# EAGLE design hacktor_watch2 (EAGLE 9.7.0)

## Sheet 1 of 2
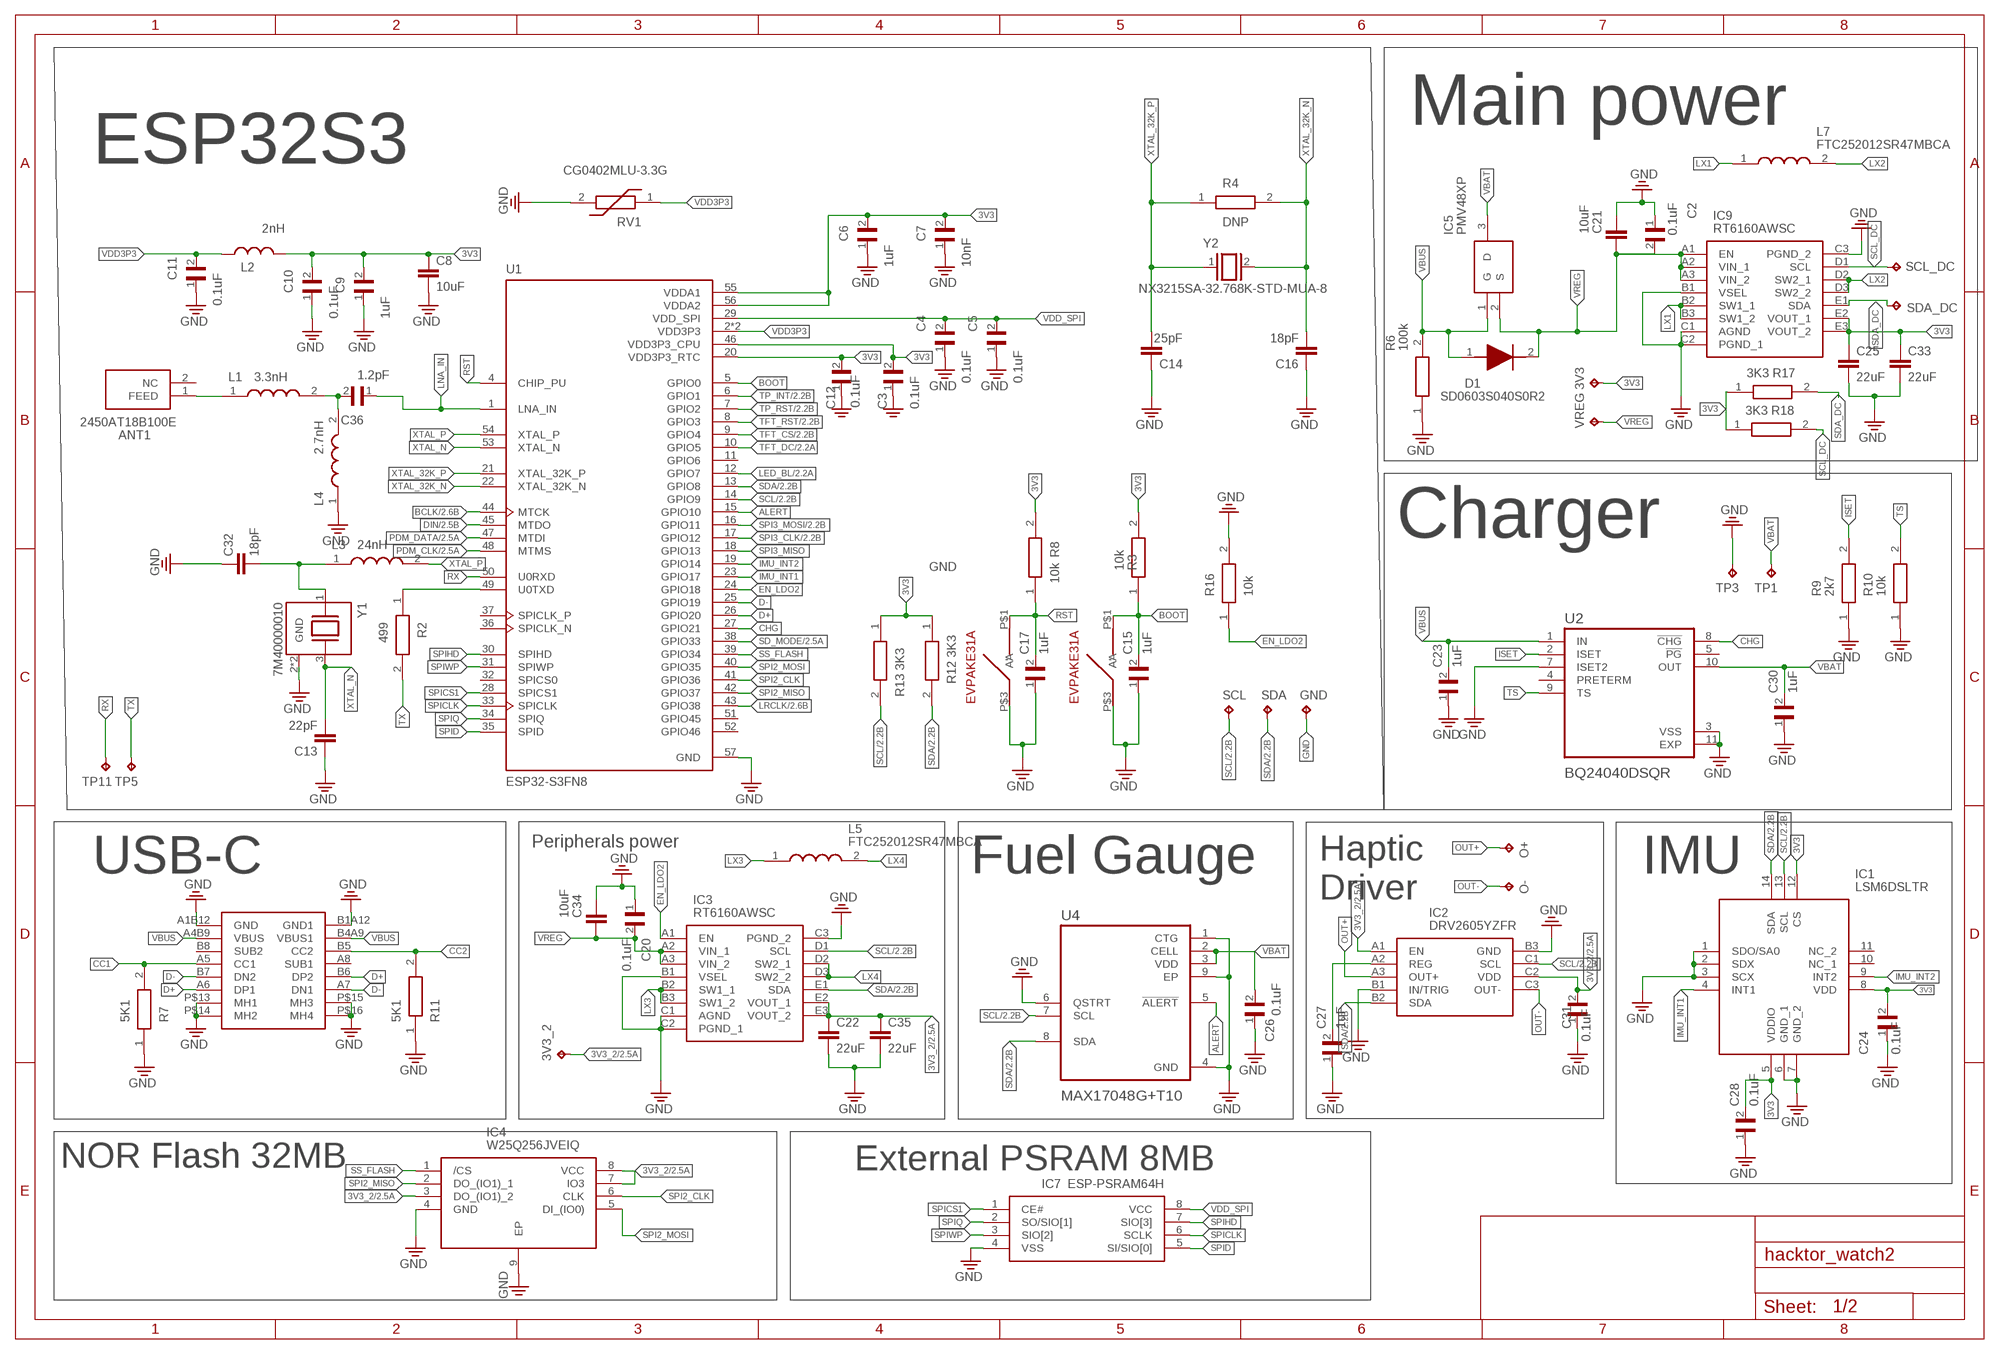
[diagram p0: schematic, sheet 1]

### Parts
3V3  TPTP20R  [TP20R]
3V3_2  TPTP20R  [TP20R]
ANT1  2450AT18B100E  [ANTC3216X140N]
C2  0.1uF  GRM011R60J152KE01L  [0201]
C3  0.1uF  GRM011R60J152KE01L  [0201]
C4  0.1uF  GRM011R60J152KE01L  [0201]
C5  0.1uF  GRM011R60J152KE01L  [0201]
C6  1uF  GRM011R60J152KE01L  [0201]
C7  10nF  GRM011R60J152KE01L  [0201]
C8  10uF  CAP_0402  [0402]
C9  1uF  GRM011R60J152KE01L  [0201]
C10  0.1uF  GRM011R60J152KE01L  [0201]
C11  0.1uF  GRM011R60J152KE01L  [0201]
C12  0.1uF  GRM011R60J152KE01L  [0201]
C13  22pF  CAP_0402  [0402]
C14  25pF  CAP_0402  [0402]
C15  1uF  GRM011R60J152KE01L  [0201]
C16  18pF  CAP_0402  [0402]
C17  1uF  GRM011R60J152KE01L  [0201]
C20  0.1uF  GRM011R60J152KE01L  [0201]
C21  10uF  CAP_0402  [0402]
C22  22uF  CAP_0402  [0402]
C23  1uF  GRM011R60J152KE01L  [0201]
C24  0.1uF  GRM011R60J152KE01L  [0201]
C25  22uF  CAP_0402  [0402]
C26  0.1uF  GRM011R60J152KE01L  [0201]
C27  1uF  GRM011R60J152KE01L  [0201]
C28  0.1uF  GRM011R60J152KE01L  [0201]
C30  1uF  GRM011R60J152KE01L  [0201]
C31  0.1uF  GRM011R60J152KE01L  [0201]
C32  18pF  CAP_0402  [0402]
C33  22uF  CAP_0402  [0402]
C34  10uF  CAP_0402  [0402]
C35  22uF  CAP_0402  [0402]
C36  1.2pF  GRM011R60J152KE01L  [0201]
D1  SD0603S040S0R2  [SD0603]
GND  TPTP20R  [TP20R]
IC1  LSM6DSLTR  [LSM6DSLTR]
IC2  DRV2605YZFR  [BGA9C50P3X3_144X144X62]
IC3  RT6160AWSC  [BGA15C40P3X5_140X230X60]
IC4  W25Q256JVEIQ  [SON127P800X600X80-9N]
IC5  PMV48XP  [SOT95P230X110-3N]
IC7  ESP-PSRAM64H  [SOIC127P600X175-8N]
IC9  RT6160AWSC  [BGA15C40P3X5_140X230X60]
L1  3.3nH  LQP15MN5N6B02D  [LQP15MN10NG02D]
L2  2nH  INDUCTOR_CHIP-0402(1006-METRIC)  [INDC1006X60N]
L3  24nH  LQP15MN5N6B02D  [LQP15MN10NG02D]
L4  2.7nH  LQP15MN5N6B02D  [LQP15MN10NG02D]
L5  FTC252012SR47MBCA  [INDC2016X100N]
L7  FTC252012SR47MBCA  [INDC2016X100N]
O+  TPTP20R  [TP20R]
O-  TPTP20R  [TP20R]
R2  499  CPF0201D7K68C1  [0201]
R3  10k  CPF0201D7K68C1  [0201]
R4  DNP  CPF0201D7K68C1  [0201]
R6  100k  CPF0201D7K68C1  [0201]
R7  5K1  CPF0201D7K68C1  [0201]
R8  10k  CPF0201D7K68C1  [0201]
R9  2k7  CPF0201D7K68C1  [0201]
R10  10k  CPF0201D7K68C1  [0201]
R11  5K1  CPF0201D7K68C1  [0201]
R12  3K3  CPF0201D7K68C1  [0201]
R13  3K3  CPF0201D7K68C1  [0201]
R16  10k  CPF0201D7K68C1  [0201]
R17  3K3  CPF0201D7K68C1  [0201]
R18  3K3  CPF0201D7K68C1  [0201]
RV1  CG0402MLU-3.3G  [VARC1005X41N]
SCL  TPTP20R  [TP20R]
SCL_DC  TPTP20R  [TP20R]
SDA  TPTP20R  [TP20R]
SDA_DC  TPTP20R  [TP20R]
TP1  TPTP20R  [TP20R]
TP3  TPTP20R  [TP20R]
TP5  TPTP20R  [TP20R]
TP11  TPTP20R  [TP20R]
U1  ESP32-S3FN8  [QFN40P700X700X90-57N]
U2  BQ24040DSQR  [SON40P200X200X80-11N]
U4  MAX17048G+T10  [SON50P200X200X80-9N]
U$1  EVPAKE31A  [EVPAKE31A]
U$3  EVPAKE31A  [EVPAKE31A]
U$5  TYPE-C16PCB0.8073  [TYPE-C16PCB0.8073]
VREG  TPTP20R  [TP20R]
Y1  7M40000010  [XTAL_7M40000010]
Y2  NX3215SA-32.768K-STD-MUA-8  [XTAL_NX3215SA-32.768K-STD-MUA-8]

### Nets
3V3 [power]: 3V3.TP C3.2 C6.2 C7.2 C8.1 C9.2 C10.2 C12.2 C24.2 C25.1 C28.2 C33.1 IC1.5(VDDIO) IC1.8(VDD) IC1.12(CS) IC9.E2(VOUT_1) IC9.E3(VOUT_2) L2.2 R3.2 R8.2 R12.1 R13.1 R17.1 R18.1 U1.20(VDD3P3_RTC) U1.46(VDD3P3_CPU) U1.55(VDDA1) U1.56(VDDA2)
3V3_2 [power]: 3V3_2.TP C22.1 C31.2 C35.1 IC2.A1(EN) IC2.C2(VDD) IC3.E2(VOUT_1) IC3.E3(VOUT_2) IC4.3(DO_(IO1)_2) IC4.7(IO3) IC4.8(VCC) ; also sheet 2
ALERT: U1.15(GPIO10) U4.5(!ALERT)
BCLK: U1.44(MTCK) ; also sheet 2
BOOT: C15.2 R3.1 U1.5(GPIO0) U$1.P$1(A)
CC1: R7.2 U$5.A5(CC1)
CC2: R11.2 U$5.B5(CC2)
CHG: U1.27(GPIO21) U2.8(!CHG)
D+: U1.26(GPIO20) U$5.A6(DP1) U$5.B6(DP2)
D-: U1.25(GPIO19) U$5.A7(DN1) U$5.B7(DN2)
DIN: U1.45(MTDO) ; also sheet 2
EN_LDO2: IC3.A1(EN) R16.1 U1.24(GPIO18)
GND: C2.1 C3.1 C4.1 C5.1 C6.1 C7.1 C8.2 C9.1 C10.1 C11.1 C12.1 C13.1 C14.1 C15.1 C16.1 C17.1 C20.1 C21.1 C22.2 C23.1 C24.1 C25.2 C26.1 C27.1 C28.1 C30.1 C31.1 C32.1 C33.2 C34.1 C35.2 GND.TP IC1.1(SDO/SA0) IC1.2(SDX) IC1.3(SCX) IC1.6(GND_1) IC1.7(GND_2) IC2.B1(IN/TRIG) IC2.B3(GND) IC3.B1(VSEL) IC3.C1(AGND) IC3.C2(PGND_1) IC3.C3(PGND_2) IC4.4(GND) IC4.9(EP) IC7.4(VSS) IC9.B1(VSEL) IC9.C1(AGND) IC9.C2(PGND_1) IC9.C3(PGND_2) L4.1 R6.1 R7.1 R9.1 R10.1 R11.1 R16.2 RV1.2 TP3.TP U1.57(GND) U2.3(VSS) U2.7(ISET2) U2.11(EXP) U4.1(CTG) U4.4(GND) U4.6(QSTRT) U4.9(EP) U$1.P$3(A') U$3.P$3(A') U$5.A1B12(GND) U$5.B1A12(GND1) U$5.P$13(MH1) U$5.P$14(MH2) U$5.P$15(MH3) U$5.P$16(MH4) Y1.2(GND) Y1.4(GND) ; also sheet 2
IMU_INT1: IC1.4(INT1) U1.23(GPIO17)
IMU_INT2: IC1.9(INT2) U1.19(GPIO14)
ISET: R9.2 U2.2(ISET)
LED_BL: U1.12(GPIO7) ; also sheet 2
LNA_IN: C36.1 U1.1(LNA_IN)
LRCLK: U1.43(GPIO38) ; also sheet 2
LX1: IC9.B2(SW1_1) IC9.B3(SW1_2) L7.1
LX2: IC9.D2(SW2_1) IC9.D3(SW2_2) L7.2
LX3: IC3.B2(SW1_1) IC3.B3(SW1_2) L5.1
LX4: IC3.D2(SW2_1) IC3.D3(SW2_2) L5.2
N$2: C32.2 L3.1 Y1.1
N$3: ANT1.1(FEED) L1.1
N$4: C36.2 L1.2 L4.2
N$7: R2.1 U1.49(U0TXD)
N$19: C27.2 IC2.A2(REG)
OUT+: IC2.A3(OUT+) O+.TP
OUT-: IC2.C3(OUT-) O-.TP
PDM_CLK: U1.48(MTMS) ; also sheet 2
PDM_DATA: U1.47(MTDI) ; also sheet 2
RST: C17.2 R8.1 U1.4(CHIP_PU) U$3.P$1(A)
RX: TP11.TP U1.50(U0RXD)
SCL: IC1.13(SCL) IC2.C1(SCL) IC3.D1(SCL) R13.2 SCL.TP U1.14(GPIO9) U4.7(SCL) ; also sheet 2
SCL_DC: IC9.D1(SCL) R18.2 SCL_DC.TP
SD_MODE: U1.38(GPIO33) ; also sheet 2
SDA: IC1.14(SDA) IC2.B2(SDA) IC3.E1(SDA) R12.2 SDA.TP U1.13(GPIO8) U4.8(SDA) ; also sheet 2
SDA_DC: IC9.E1(SDA) R17.2 SDA_DC.TP
SPI2_CLK: IC4.6(CLK) U1.41(GPIO36)
SPI2_MISO: IC4.2(DO_(IO1)_1) U1.42(GPIO37)
SPI2_MOSI: IC4.5(DI_(IO0)) U1.40(GPIO35)
SPI3_CLK: U1.17(GPIO12) ; also sheet 2
SPI3_MISO: U1.18(GPIO13)
SPI3_MOSI: U1.16(GPIO11) ; also sheet 2
SPICLK: IC7.6(SCLK) U1.33(SPICLK)
SPICS1: IC7.1(CE#) U1.28(SPICS1)
SPID: IC7.5(SI/SIO[0]) U1.35(SPID)
SPIHD: IC7.7(SIO[3]) U1.30(SPIHD)
SPIQ: IC7.2(SO/SIO[1]) U1.34(SPIQ)
SPIWP: IC7.3(SIO[2]) U1.31(SPIWP)
SS_FLASH: IC4.1(/CS) U1.39(GPIO34)
TFT_CS: U1.9(GPIO4) ; also sheet 2
TFT_DC: U1.10(GPIO5) ; also sheet 2
TFT_RST: U1.8(GPIO3) ; also sheet 2
TP_INT: U1.6(GPIO1) ; also sheet 2
TP_RST: U1.7(GPIO2) ; also sheet 2
TS: R10.2 U2.9(TS)
TX: R2.2 TP5.TP
VBAT [power]: C26.2 C30.2 IC5.3(D) TP1.TP U2.10(OUT) U4.2(CELL) U4.3(VDD)
VBUS [power]: C23.2 D1.1(A) IC5.1(G) R6.2 U2.1(IN) U$5.A4B9(VBUS) U$5.B4A9(VBUS1)
VDD3P3 [power]: C11.2 L2.1 RV1.1 U1.2(VDD3P3) U1.3(VDD3P3)
VDD_SPI [power]: C4.2 C5.2 IC7.8(VCC) U1.29(VDD_SPI)
VREG [power]: C2.2 C20.2 C21.2 C34.2 D1.2(K) IC3.A2(VIN_1) IC3.A3(VIN_2) IC5.2(S) IC9.A1(EN) IC9.A2(VIN_1) IC9.A3(VIN_2) VREG.TP
XTAL_32K_N: C16.2 R4.2 U1.22(XTAL_32K_N) Y2.2
XTAL_32K_P: C14.2 R4.1 U1.21(XTAL_32K_P) Y2.1
XTAL_N: C13.2 U1.53(XTAL_N) Y1.3
XTAL_P: L3.2 U1.54(XTAL_P)
Unconnected: ANT1.2(NC) IC1.10(NC_1) IC1.11(NC_2) U1.11(GPIO6) U1.32(SPICS0) U1.36(SPICLK_N) U1.37(SPICLK_P) U1.51(GPIO45) U1.52(GPIO46) U2.4(PRETERM) U2.5(!PG) U$5.A8(SUB1) U$5.B8(SUB2)

### Notes on the sheet
- Main power
- ESP32S3
- Charger
- Peripherals power
- USB-C | Fuel Gauge | IMU
- Haptic 
  Driver
- NOR Flash 32MB | External PSRAM 8MB

## Sheet 2 of 2
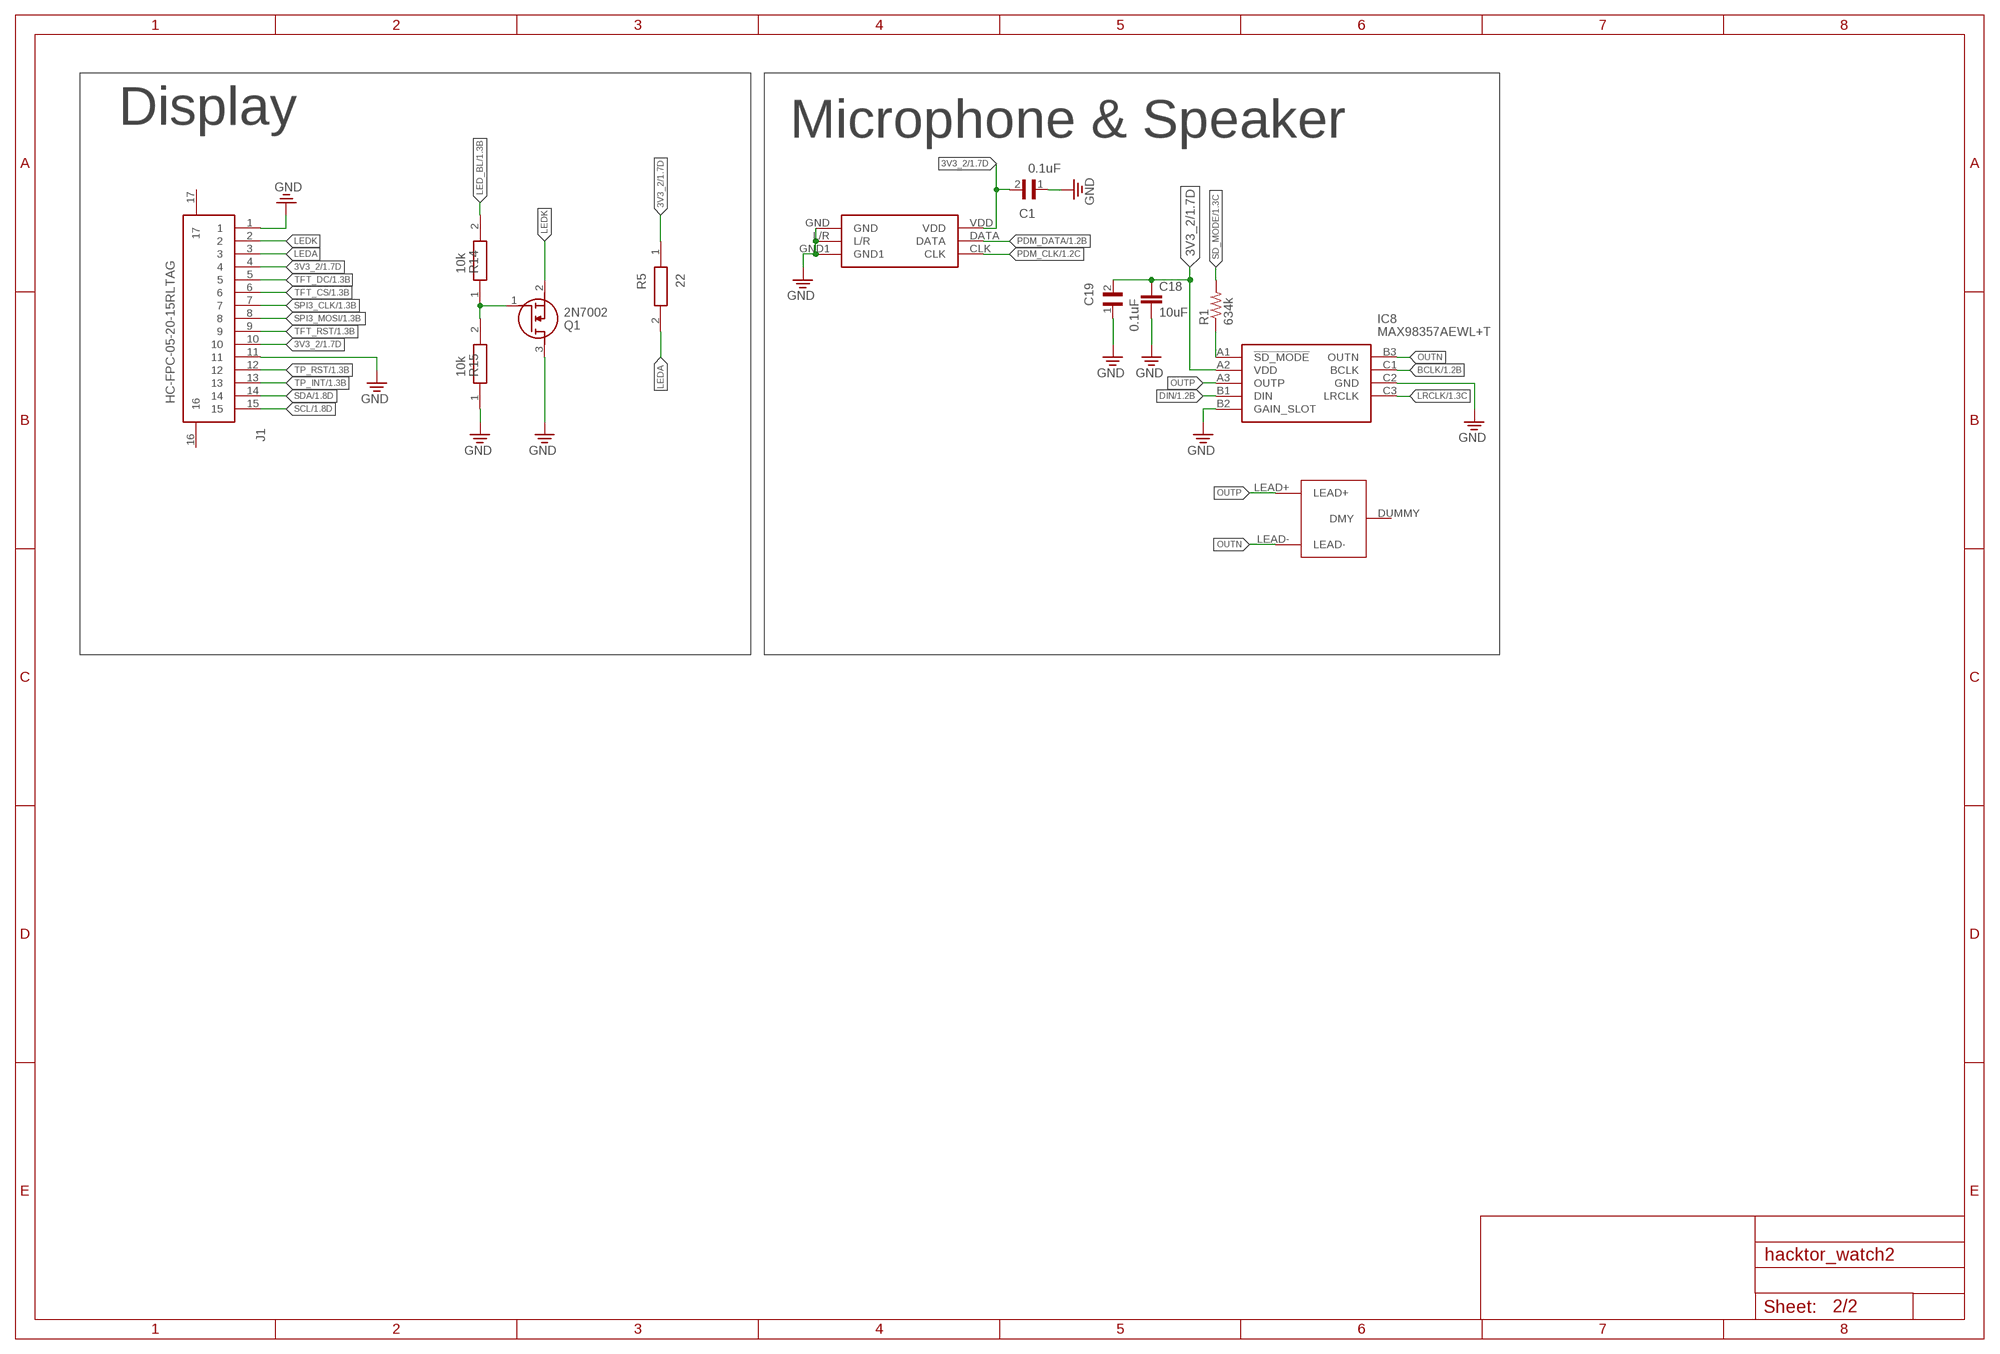
[diagram p1: schematic, sheet 2]

### Parts
C1  0.1uF  GRM011R60J152KE01L  [0201]
C18  10uF  CAP_0402  [0402]
C19  0.1uF  GRM011R60J152KE01L  [0201]
IC8  MAX98357AEWL+T  [BGA9C40P3X3_144X135X69]
J1  HC-FPC-05-20-15RLTAG  [HC-FPC-05-20-15RLTAG]
Q1  2N7002  [SOT96P240X120-3N]
R1  634k  RES_0402  [0402]
R5  22  CPF0201D7K68C1  [0201]
R14  10k  CPF0201D7K68C1  [0201]
R15  10k  CPF0201D7K68C1  [0201]
U$4  TE054003-1  [TE054003-1]
U$6  LMD2718T261-OA1  [LMD2718T261-OA1]

### Nets
3V3_2 [power]: C1.2 C18.1 C19.2 IC8.A2(VDD) J1.4 J1.10 R5.1 U$6.VDD ; also sheet 1
BCLK: IC8.C1(BCLK) ; also sheet 1
DIN: IC8.B1(DIN) ; also sheet 1
GND: C1.1 C18.2 C19.1 IC8.B2(GAIN_SLOT) IC8.C2(GND) J1.1 J1.11 Q1.3(D) R15.1 U$6.GND U$6.GND1 U$6.L/R ; also sheet 1
LED_BL: R14.2 ; also sheet 1
LEDA: J1.3 R5.2
LEDK: J1.2 Q1.2(S)
LRCLK: IC8.C3(LRCLK) ; also sheet 1
N$1: IC8.A1(!SD_MODE) R1.1
N$17: Q1.1(G) R14.1 R15.2
OUTN: IC8.B3(OUTN) U$4.LEAD-
OUTP: IC8.A3(OUTP) U$4.LEAD+
PDM_CLK: U$6.CLK ; also sheet 1
PDM_DATA: U$6.DATA ; also sheet 1
SCL: J1.15 ; also sheet 1
SD_MODE: R1.2 ; also sheet 1
SDA: J1.14 ; also sheet 1
SPI3_CLK: J1.7 ; also sheet 1
SPI3_MOSI: J1.8 ; also sheet 1
TFT_CS: J1.6 ; also sheet 1
TFT_DC: J1.5 ; also sheet 1
TFT_RST: J1.9 ; also sheet 1
TP_INT: J1.13 ; also sheet 1
TP_RST: J1.12 ; also sheet 1
Unconnected: J1.16 J1.17 U$4.DUMMY(DMY)

### Notes on the sheet
- Display | Microphone & Speaker

## Library data of the parts
3V3 3V3_2 GND O+ O- SCL SCL_DC SDA SDA_DC TP1 TP3 TP5 TP11 VREG = Hector_Watch:TP: Test pad
ANT1 = 2450AT18B100E:2450AT18B100E: Antennas 2.45GHz ANTENNA Source: Datasheet <https://www.johansontechnology.com/datasheets/2450AT18B100/2450AT18B100.pdf>; ARROW_PART_NUMBER: 2450AT18B100E; ARROW_PRICE-STOCK: https://www.arrow.com/en/products/2450at18b100e/johanson-dielectrics?utm_currency=USD&region=nac; DESCRIPTION: Antennas 2.45GHz ANTENNA; HEIGHT: 1.4mm; MANUFACTURER_NAME: JOHANSON TECHNOLOGY; MANUFACTURER_PART_NUMBER: 2450AT18B100E; MOUSER_PART_NUMBER: 609-2450AT18B100E; MOUSER_PRICE-STOCK: https://www.mouser.co.uk/ProductDetail/Johanson-Technology/2450AT18B100E?qs=yCnrNFeXz%252Bh5MFsFIXGZGA%3D%3D
C1-C7 C9-C12 C15 C17 C19 C20 C23 C24 C26-C28 C30 C31 C36 = GRM011R60J152KE01L:GRM011R60J152KE01L: Check availability <https://pricing.snapeda.com/parts/GRM011R60J152KE01L/Murata/view-part?ref=eda>; SPICEPREFIX: C
C8 C13 C14 C16 C18 C21 C22 C25 C32-C35 = Perfect_0402:CAP_0402: 0402 (1005 Metric) Nick Garner - TeleSense
D1 = SD0603S040S0R2:SD0603S040S0R2: Schottky Barrier Rectifier Diode Source: Datasheet <http://datasheets.avx.com/schottky.pdf>; ARROW_PART_NUMBER: SD0603S040S0R2; ARROW_PRICE-STOCK: https://www.arrow.com/en/products/sd0603s040s0r2/avx?region=europe; DESCRIPTION: Schottky Barrier Rectifier Diode; HEIGHT: mm; MANUFACTURER_NAME: Kyocera AVX; MANUFACTURER_PART_NUMBER: SD0603S040S0R2; MOUSER_PART_NUMBER: 581-SD0603S040S0R2; MOUSER_PRICE-STOCK: https://www.mouser.co.uk/ProductDetail/KYOCERA-AVX/SD0603S040S0R2?qs=jCA%252BPfw4LHYAQo0EAXFnAA%3D%3D
IC1 = LSM6DSLTR:LSM6DSLTR: IMUs - Inertial Measurement Units CONSUMER MEMS Source: Datasheet <https://www.st.com/resource/en/datasheet/lsm6dsl.pdf> Check availability <https://pricing.snapeda.com/parts/LSM6DSLTR/Analog%20Devices/view-part?ref=eda>; AVAILABILITY: In Stock; CHECK_PRICES: https://www.snapeda.com/parts/LSM6DSLTR/Analog+Devices/view-part/?ref=eda; DESCRIPTION: Inemo Inertial Module, 2/4/8/16G, Lga-14; Mems Module Function:Tri-Axis Gyroscope, Tri-Axis Accelerometer; Supply Voltage Min:1.71V; Supply Voltage Max:3.6V; Sensor Case Style:Lga; No. Of Pins:14Pins; Product Range:- Rohs Compliant: Yes |Stmicroelectronics LSM6DSLTR; MF: Analog Devices; MP: LSM6DSLTR; PACKAGE: None; PRICE: None; PURCHASE-URL: https://www.snapeda.com/api/url_track_click_mouser/?unipart_id=12092544&manufacturer=Analog Devices&part_name=LSM6DSLTR&search_term=lsm6dsltr; SNAPEDA_LINK: https://www.snapeda.com/parts/LSM6DSLTR/Analog+Devices/view-part/?ref=snap
IC2 = DRV2605YZFR:DRV2605YZFR: Haptic Driver for ERM/LRA with Built-In Library and Smart Loop Architecture Source: Datasheet <http://www.ti.com/lit/gpn/drv2605>; ARROW_PART_NUMBER: DRV2605YZFR; ARROW_PRICE-STOCK: https://www.arrow.com/en/products/drv2605yzfr/texas-instruments?region=nac; DESCRIPTION: Haptic Driver for ERM/LRA with Built-In Library and Smart Loop Architecture; HEIGHT: 0.625mm; MANUFACTURER_NAME: Texas Instruments; MANUFACTURER_PART_NUMBER: DRV2605YZFR
IC3 IC9 = RT6160AWSC:RT6160AWSC: Buck-Boost Regulator Positive Output Step-Up/Step-Down I2C DC-DC Controller IC 15-WL-CSP (BSC) (1.4x2.3) Source: Datasheet <https://www.richtek.com/SaveDownload.aspx?specid=RT6160A>; DESCRIPTION: Buck-Boost Regulator Positive Output Step-Up/Step-Down I2C DC-DC Controller IC 15-WL-CSP (BSC) (1.4x2.3); HEIGHT: 0.6mm; MANUFACTURER_NAME: RICHTEK; MANUFACTURER_PART_NUMBER: RT6160AWSC; MOUSER_PART_NUMBER: 835-RT6160AWSC; MOUSER_PRICE-STOCK: https://www.mouser.co.uk/ProductDetail/Richtek/RT6160AWSC?qs=amGC7iS6iy%2FLd9PSoixZXQ%3D%3D
IC4 = W25Q256JVEIQ:W25Q256JVEIQ: 256M-bit Serial Flash Memory with uniform 4KB sectors and Dual/Quad SPI Source: Datasheet <https://www.winbond.com/hq/search-resource-file.jsp?partNo=W25Q256JVEIQ&type=datasheet>; ARROW_PART_NUMBER: W25Q256JVEIQ; ARROW_PRICE-STOCK: https://www.arrow.com/en/products/w25q256jveiq/winbond-electronics?utm_currency=USD&region=nac; DESCRIPTION: 256M-bit Serial Flash Memory with uniform 4KB sectors and Dual/Quad SPI; HEIGHT: 0.8mm; MANUFACTURER_NAME: Winbond; MANUFACTURER_PART_NUMBER: W25Q256JVEIQ; MOUSER_PART_NUMBER: 454-W25Q256JVEIQ; MOUSER_PRICE-STOCK: https://www.mouser.co.uk/ProductDetail/Winbond/W25Q256JVEIQ?qs=qSfuJ%252Bfl%2Fd4o%2FNFUf7yCgA%3D%3D
IC5 = PMV48XP:PMV48XP: P-channel Trench MOSFET Source: Datasheet; DESCRIPTION: P-channel Trench MOSFET; HEIGHT: mm; MANUFACTURER_NAME: Nexperia; MANUFACTURER_PART_NUMBER: PMV48XP; MOUSER_PART_NUMBER: N/A; MOUSER_PRICE-STOCK: https://www.mouser.co.uk/ProductDetail/Nexperia/PMV48XP?qs=vHuUswq2%252BsyADRknxKe6jA%3D%3D
IC7 = ESP-PSRAM64H:ESP-PSRAM64H: ESP-PSRAM64 and ESP-PSRAM64H 64 Mbit serial pseudo SRAM Source: Datasheet <https://www.espressif.com/sites/default/files/documentation/esp-psram64_esp-psram64h_datasheet_en.pdf>; DATASHEET: https://cdn-shop.adafruit.com/product-files/4677/4677_esp-psram64_esp-psram64h_datasheet_en.pdf; DESCRIPTION: ESP-PSRAM64 and ESP-PSRAM64H 64 Mbit serial pseudo SRAM; HEIGHT: 1.75mm; MANUFACTURER_NAME: Espressif Systems; MANUFACTURER_PART_NUMBER: ESP-PSRAM64H
IC8 = MAX98357AEWL+T:MAX98357AEWL+T: Audio Amplifiers MAX98357AEWL+T Source: Datasheet <https://datasheets.maximintegrated.com/en/ds/MAX98357A-MAX98357B.pdf>; ARROW_PART_NUMBER: MAX98357AEWL+T; ARROW_PRICE-STOCK: https://www.arrow.com/en/products/max98357aewlt/analog-devices?region=nac; DESCRIPTION: Audio Amplifiers MAX98357AEWL+T; HEIGHT: 0.69mm; MANUFACTURER_NAME: Analog Devices; MANUFACTURER_PART_NUMBER: MAX98357AEWL+T; MOUSER_PART_NUMBER: 700-MAX98357AEWL+T; MOUSER_PRICE-STOCK: https://www.mouser.co.uk/ProductDetail/Analog-Devices-Maxim-Integrated/MAX98357AEWL%2bT?qs=ZrtEiRxEuI4mjqOyZP4d0A%3D%3D
J1 = FPC Connectors:HC-FPC-05-20-15RLTAG: FFC & FPC Connectors 0.5 FPC ZIF SMT Hsg Assy 15Ckt EmbsTpPkg Source: Datasheet <https://www.molex.com/pdm_docs/sd/527451597_sd.pdf>; DESCRIPTION: Flip type -25℃~+85℃ 15P Dual-sided contacts / top and bottom connection Horizontal attachment 0.5mm SMD,P=0.5mm,Surface Mount，Right Angle FFC, FPC (Flat Flexible) Connector Assemblies ROHS; HEIGHT: 2mm; JLCPCB_COMPONENT: https://jlcpcb.com/partdetail/HCTL-HC_FPC_05_2015RLTAG/C19270550; MANUFACTURER_NAME: HCTL; MANUFACTURER_PART_NUMBER: HC-FPC-05-20-15RLTAG
L1 L3 L4 = LQP15MN5N6B02D:LQP15MN5N6B02D: Inductor SMD 0402 5.6nH Murata LQP15M Series Wire-wound SMD Inductor 5.6 nH +/-0.1nH Wire-Wound 140mA Idc Q:13 Source: Datasheet <https://psearch.en.murata.com/inductor/product/LQP15MN5N6B02#.html>; ARROW_PART_NUMBER: LQP15MN5N6B02D; ARROW_PRICE-STOCK: https://www.arrow.com/en/products/lqp15mn5n6b02d/murata-manufacturing; DESCRIPTION: Inductor SMD 0402 5.6nH Murata LQP15M Series Wire-wound SMD Inductor 5.6 nH +/-0.1nH Wire-Wound 140mA Idc Q:13; HEIGHT: 0.45mm; MANUFACTURER_NAME: Murata Electronics; MANUFACTURER_PART_NUMBER: LQP15MN5N6B02D; SPICEPREFIX: L
L2 = Tinkercad:INDUCTOR: Inductor Fixed - Generic; CATEGORY: Inductor; SPICEPREFIX: L; SUB-CATEGORY: Fixed
L5 L7 = MLP2016SR47MT0S1:FTC252012SR47MBCA: SMD / SMT Inductors (Coils), L=0.47?H, L x W x T : Source: Datasheet <https://product.tdk.com/system/files/dam/doc/product/inductor/inductor/smd/catalog/inductor_commercial_power_mlp2016_en.pdf>; DESCRIPTION: SMD / SMT Inductors (Coils), L=0.47?H, L x W x T :; HEIGHT: 1mm; JLCPCB: https://jlcpcb.com/partdetail/6763488-FTC252012SR47MBCA/C5832368; MANUFACTURER_NAME: TDK; MANUFACTURER_PART_NUMBER: FTC252012SR47MBCA
Q1 = Library:2N7002: N-channel MOSFET,2N7002 0.115A 60V Source: Datasheet <https://www.onsemi.com/pub/Collateral/NDS7002A-D.PDF>; ARROW_PART_NUMBER: 2N7002; ARROW_PRICE-STOCK: https://www.arrow.com/en/products/2n7002/on-semiconductor?region=europe; DESCRIPTION: N-channel MOSFET,2N7002 0.115A 60V; HEIGHT: 1.2mm; MANUFACTURER_NAME: onsemi; MANUFACTURER_PART_NUMBER: 2N7002; MOUSER_PART_NUMBER: 512-2N7002; MOUSER_PRICE-STOCK: https://www.mouser.co.uk/ProductDetail/onsemi-Fairchild/2N7002?qs=0dwsXDNhqlz66WJJhrTFjQ%3D%3D
R1 = Perfect_0402:RES_0402: 0402 (1005 Metric) Nick Garner - TeleSense
R2-R5 R7 R8 R11-R18 = CPF0201D7K68C1:CPF0201D7K68C1: 7.68k 0201 Thin Film Surface Mount Fixed Resistor +/-0.5% 0.031W CPF0201D7K68C1 Source: Datasheet <http://www.te.com/commerce/DocumentDelivery/DDEController?Action=showdoc&DocId=Data Sheet1773200-1ApdfEnglishENG_DS_1773200-1_A.pdf4-2176215-6>; SPICEPREFIX: R
R6 R9 R10 = CPF0201D7K68C1:CPF0201D7K68C1: 7.68k 0201 Thin Film Surface Mount Fixed Resistor +/-0.5% 0.031W CPF0201D7K68C1 Source: Datasheet <http://www.te.com/commerce/DocumentDelivery/DDEController?Action=showdoc&DocId=Data Sheet1773200-1ApdfEnglishENG_DS_1773200-1_A.pdf4-2176215-6>
RV1 = CG0402MLU-3.3G:CG0402MLU-3.3G: ESD Suppressors / TVS Diodes CHIP GUARD 3.3VOLT Source: Datasheet <https://www.bourns.com/docs/Product-Datasheets/MLU.pdf>; ARROW_PART_NUMBER: CG0402MLU-3.3G; ARROW_PRICE-STOCK: https://www.arrow.com/en/products/cg0402mlu-3.3g/bourns?utm_currency=USD&region=nac; DESCRIPTION: ESD Suppressors / TVS Diodes CHIP GUARD 3.3VOLT; HEIGHT: 0.41mm; MANUFACTURER_NAME: Bourns; MANUFACTURER_PART_NUMBER: CG0402MLU-3.3G; MOUSER_PART_NUMBER: 652-CG0402MLU-3.3G; MOUSER_PRICE-STOCK: https://www.mouser.co.uk/ProductDetail/Bourns/CG0402MLU-3.3G?qs=m8myXnDJXpWVM8EQWErxtQ%3D%3D
U1 = ESP32-S3FN8:ESP32-S3FN8: Check availability <https://pricing.snapeda.com/parts/ESP32-S3FN8/Espressif%20Systems/view-part?ref=eda> Check availability <https://pricing.snapeda.com/parts/ESP32-S3FN8/Espressif%20Systems/view-part?ref=eda> Check availability <https://pricing.snapeda.com/parts/ESP32-S3FN8/Espressif%20Systems/view-part?ref=eda>; AVAILABILITY: In Stock; CHECK_PRICES: https://www.snapeda.com/parts/ESP32-S3FN8/Espressif+Systems/view-part/?ref=eda; DESCRIPTION: Espressif Systems [ENGINEERING SAMPLES]SMD IC , Dual-Core MCU, Wi-Fi 2.4G & BLE 5.0 combo, 8 MB Octal SPI PSRAM, QFN 56-pin, 7*7 mm; MF: Espressif Systems; MP: ESP32-S3FN8; PACKAGE: None; PRICE: None; PURCHASE-URL: https://www.snapeda.com/api/url_track_click_mouser/?unipart_id=9528858&manufacturer=Espressif Systems&part_name=ESP32-S3FN8&search_term=None; SNAPEDA_LINK: https://www.snapeda.com/parts/ESP32-S3FN8/Espressif+Systems/view-part/?ref=snap
U2 = BQ24040DSQR:BQ24040DSQR: Check availability <https://pricing.snapeda.com/parts/BQ24040DSQR/Texas%20Instruments/view-part?ref=eda>; AVAILABILITY: In Stock; CHECK_PRICES: https://www.snapeda.com/parts/BQ24040DSQR/Texas+Instruments/view-part/?ref=eda; DESCRIPTION: Standalone 1-cell 1-A linear battery charger with 4.2-V VBAT and Temperature Sensing; MF: Texas Instruments; MP: BQ24040DSQR; PACKAGE: WSON-10 Texas Instruments; PRICE: None; PURCHASE-URL: https://www.snapeda.com/api/url_track_click_mouser/?unipart_id=229310&manufacturer=Texas Instruments&part_name=BQ24040DSQR&search_term=None; SNAPEDA_LINK: https://www.snapeda.com/parts/BQ24040DSQR/Texas+Instruments/view-part/?ref=snap
U4 = MAX17048G_T10:MAX17048G+T10: Check availability <https://pricing.snapeda.com/parts/MAX17048G%2BT10/Analog%20Devices/view-part?ref=eda>; AVAILABILITY: In Stock; CHECK_PRICES: https://www.snapeda.com/parts/MAX17048G+T10/Analog+Devices/view-part/?ref=eda; DESCRIPTION: 3µA 1-Cell/2-Cell Fuel Gauge with ModelGauge; MF: Analog Devices; MP: MAX17048G+T10; PACKAGE: TDFN-8 Maxim; PRICE: None; PURCHASE-URL: https://www.snapeda.com/api/url_track_click_mouser/?unipart_id=329239&manufacturer=Analog Devices&part_name=MAX17048G+T10&search_term=None; SNAPEDA_LINK: https://www.snapeda.com/parts/MAX17048G+T10/Analog+Devices/view-part/?ref=snap
U$1 U$3 = HW2:EVPAKE31A
U$4 = HW2:TE054003-1
U$5 = HW2:TYPE-C16PCB0.8073
U$6 = HW2:LMD2718T261-OA1
Y1 = 7M40000010:7M40000010: Check availability <https://pricing.snapeda.com/parts/7M40000010/TXC%20CORPORATION/view-part?ref=eda>; AVAILABILITY: In Stock; CHECK_PRICES: https://www.snapeda.com/parts/7M40000010/TXC+CORPORATION/view-part/?ref=eda; DESCRIPTION: 40 MHz ±10ppm Crystal 12pF 4-SMD, No Lead; MF: TXC CORPORATION; MP: 7M40000010; PACKAGE: NON STANDARD-4 TXC; PRICE: None; SNAPEDA_LINK: https://www.snapeda.com/parts/7M40000010/TXC+CORPORATION/view-part/?ref=snap; SPICEPREFIX: J
Y2 = NX3215SA-32.768K-STD-MUA-8:NX3215SA-32.768K-STD-MUA-8: Check availability <https://pricing.snapeda.com/parts/NX3215SA-32.768K-STD-MUA-8/NDK%20America%2C/view-part?ref=eda>; AVAILABILITY: In Stock; CHECK_PRICES: https://www.snapeda.com/parts/NX3215SA-32.768K-STD-MUA-8/NDK+America%252C+Inc./view-part/?ref=eda; DESCRIPTION: 32.768 kHz ±20ppm Crystal 12.5pF 70 kOhms 2-SMD, No Lead; MF: NDK America,; MP: NX3215SA-32.768K-STD-MUA-8; PACKAGE: SMD-2 NDK; PRICE: None; SNAPEDA_LINK: https://www.snapeda.com/parts/NX3215SA-32.768K-STD-MUA-8/NDK+America%252C+Inc./view-part/?ref=snap; SPICEPREFIX: B

## Net classes
0 default: width 0.152 mm
1 power: width 0.15 mm

## Board
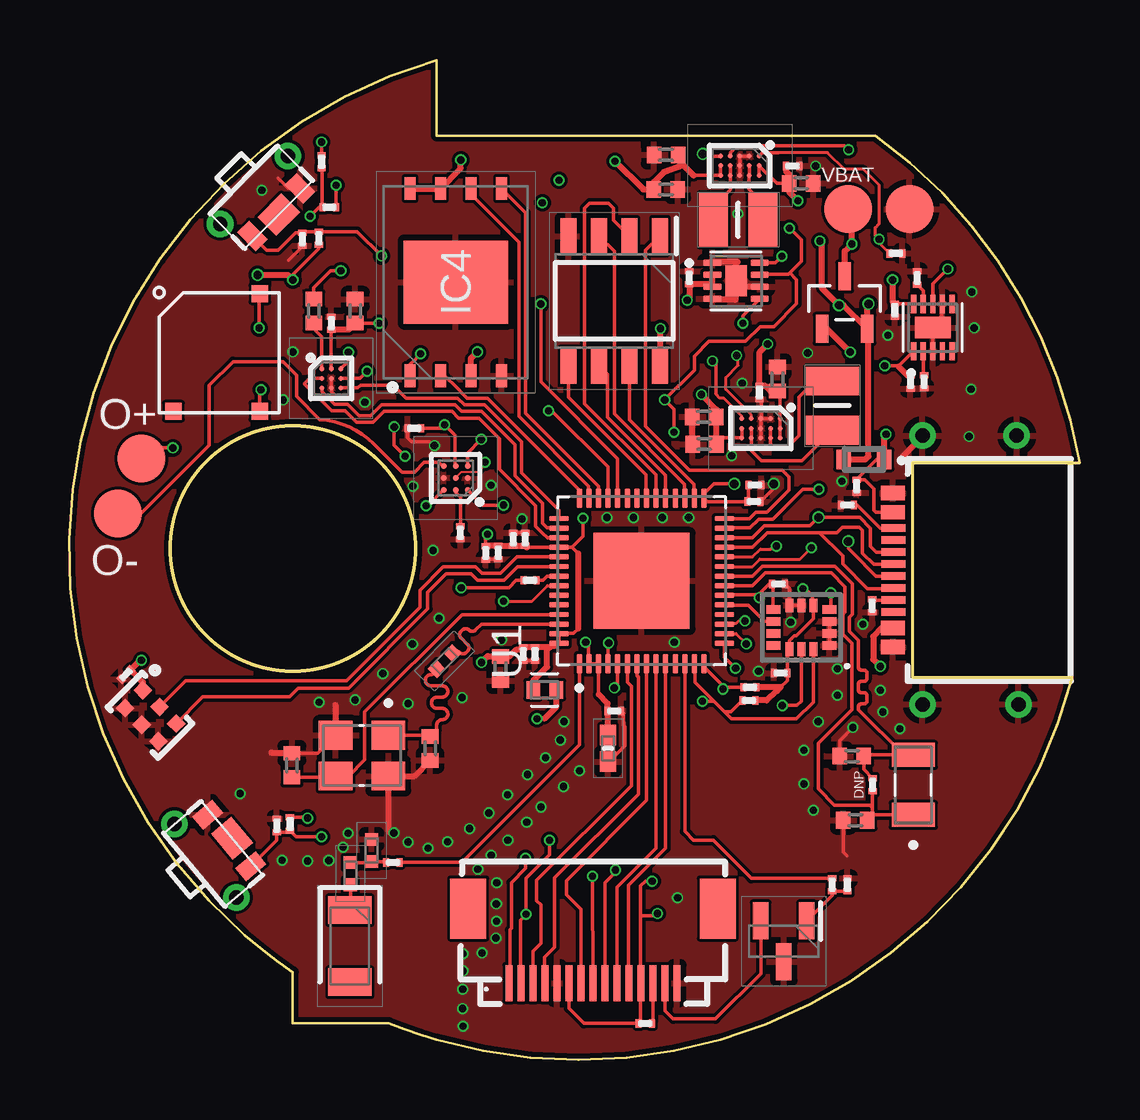
[diagram p2: board, top side]
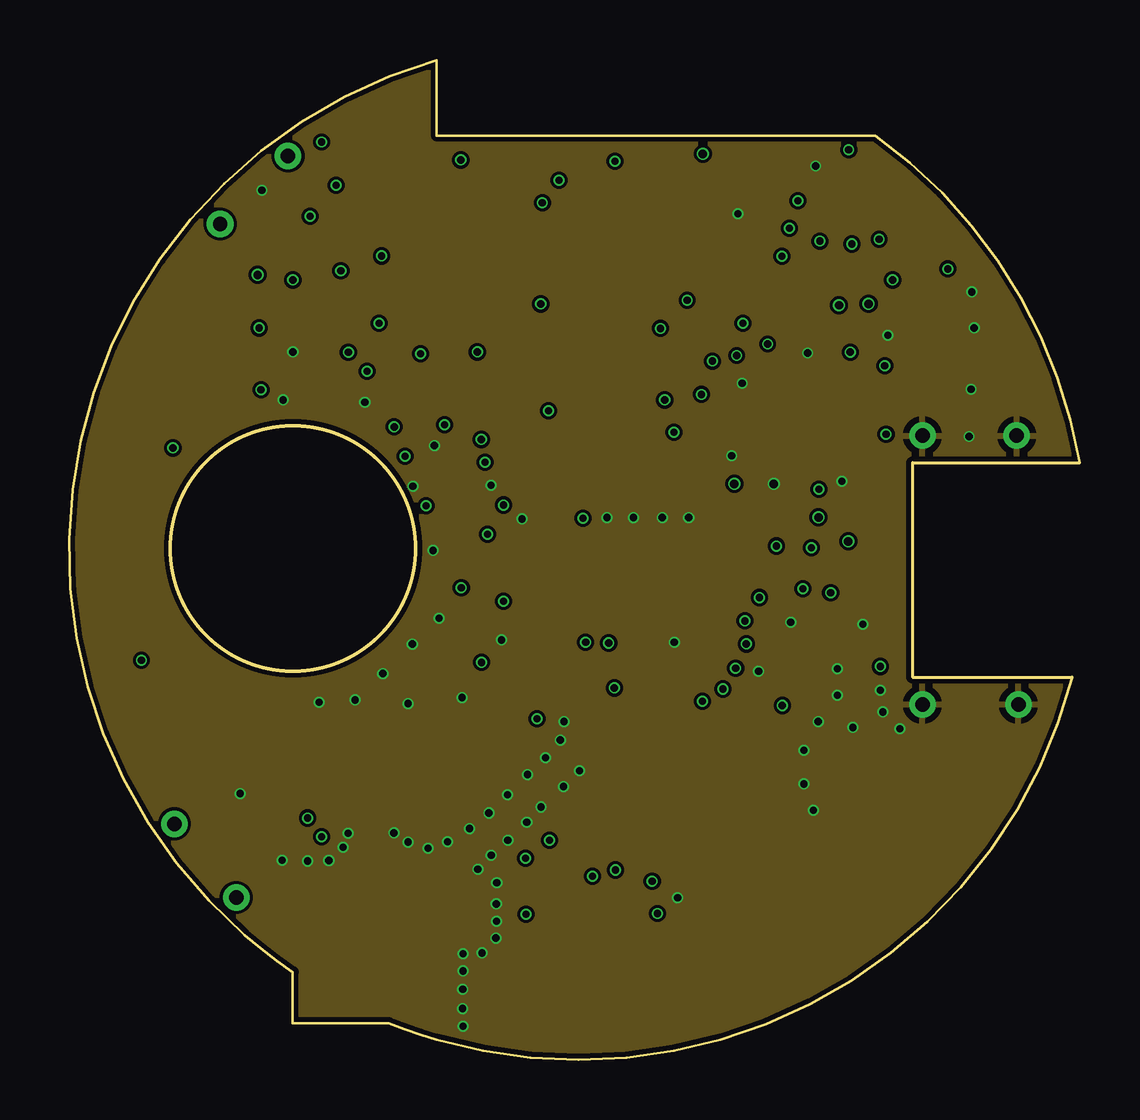
[diagram p3: board, inner layer Route2]
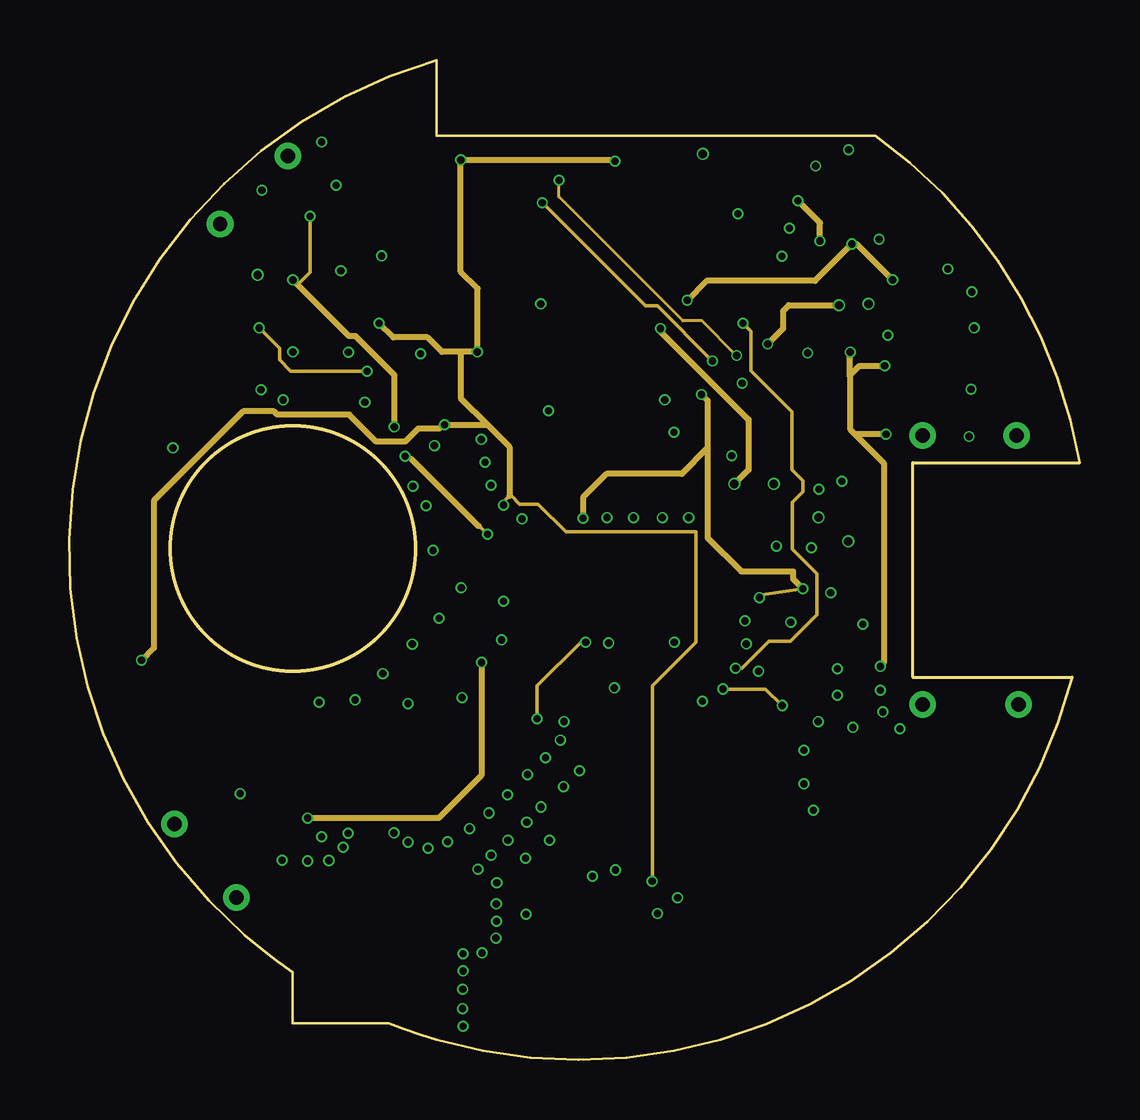
[diagram p4: board, inner layer Route15]
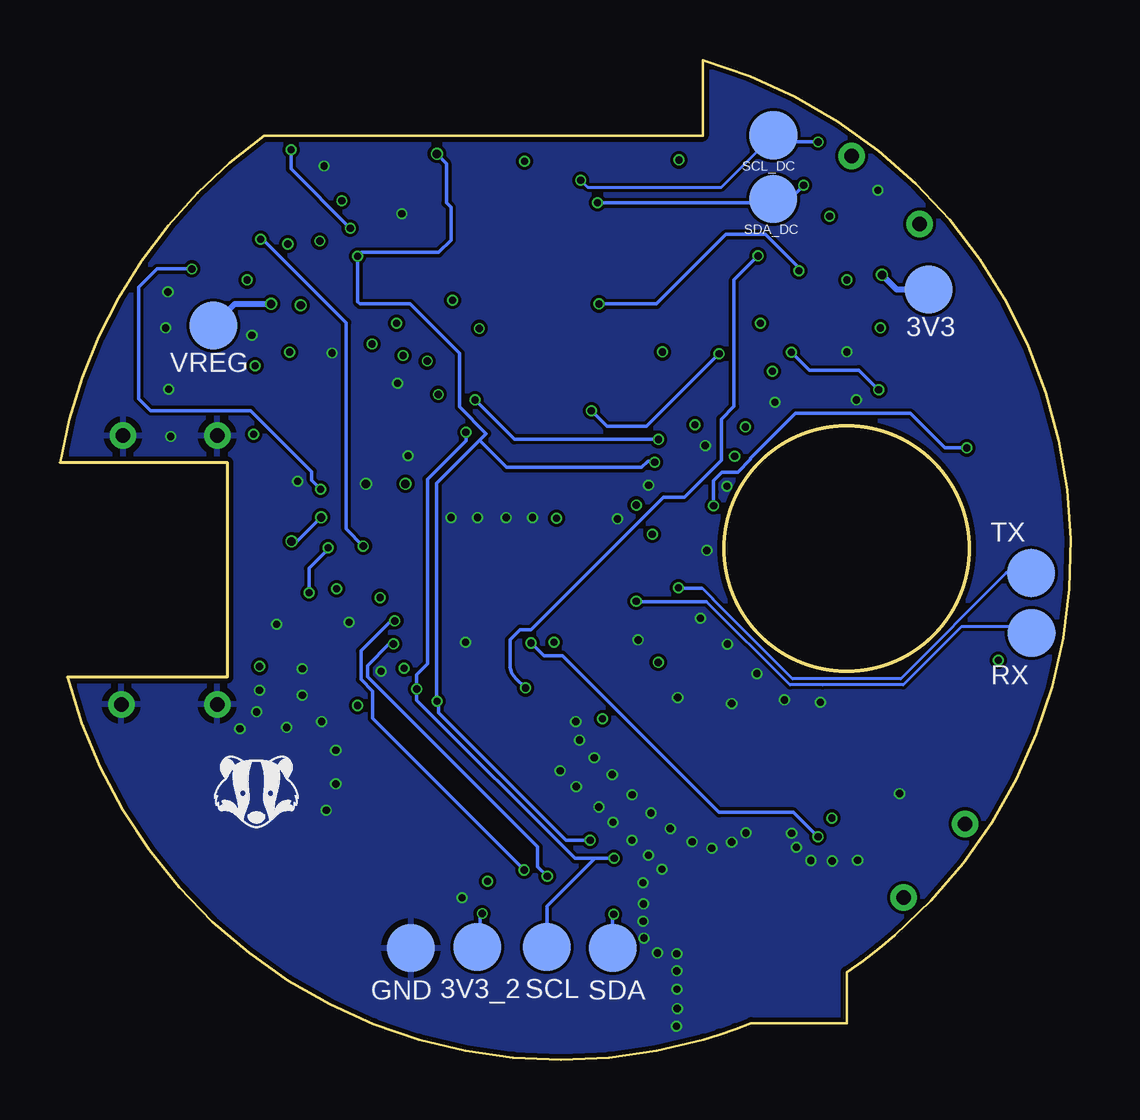
[diagram p5: board, bottom side, seen from below]

Size 42.13 x 41.66 mm. Coordinates in mm from the lower left corner, seen from the top.
Outline: 15.32,0.84 arc-6 13.33,1.53 9.33,1.53 9.33,3.65 arc-7 7.33,5.19 arc-123 15.33,41.66 15.33,38.51 33.62,38.51 arc-44 42.13,24.88 35.16,24.88 35.16,15.94 41.82,15.94 arc-92 15.32,0.84
Outline: circle at 9.34,21.31 radius 5.1
Copper layers (1+2*15+16): Top 0.035mm / dielectric 0.2mm / Route2 0.0175mm / dielectric 1.065mm / Route15 0.0175mm / dielectric 0.2mm / Bottom 0.035mm
Design rules "jlcpcb-4layers.dru *": minimum track width 3.5mil, minimum drill 0.15mm, track to track 5mil, track to pad 0.2mm, pad to pad 5mil, via to via 0.5mm, smd to smd 5mil, copper to edge 0.2mm, drill to drill 6mil, minimum pad ring 10mil, minimum via ring 0.075mm, stop-mask expansion 0.05mm, vias tented up to drill 0.5mm, thermal gap 10mil
tKeepout: 1 lines

### Footprints (pad centres in the part's own frame; a part is rotated, then mirrored left to right if it is on the bottom)
TP20R = smd 2 x 2: TP 0,0
ANTC3216X140N = smd 1.15 x 1.8: 1 -1.5,0; 2 1.5,0
0201 = smd 0.35 x 0.25: 1 0,0.275; 2 0,-0.275
0402 = smd 0.6 x 0.7: 1 -0.5,0; 2 0.5,0
SD0603 = smd 0.6 x 0.8: 1 -0.85,0; 2 0.85,0
LSM6DSLTR = smd 0.575 x 0.35: 1 -1.163,0.75; 2 -1.163,0.25; 3 -1.163,-0.25; 4 -1.163,-0.75; 8 1.163,-0.75; 9 1.163,-0.25; 10 1.163,0.25; 11 1.163,0.75 | smd 0.35 x 0.575: 5 -0.5,-0.912; 6 0,-0.912; 7 0.5,-0.912; 12 0.5,0.912; 13 0,0.912; 14 -0.5,0.912
BGA9C50P3X3_144X144X62 = smd 0.25 x 0.25: A1 -0.5,0.5; A2 0,0.5; A3 0.5,0.5; B1 -0.5,0; B2 0,0; B3 0.5,0; C1 -0.5,-0.5; C2 0,-0.5; C3 0.5,-0.5
BGA15C40P3X5_140X230X60 = smd 0.216 x 0.216: A1 -0.4,0.8; A2 0,0.8; A3 0.4,0.8; B1 -0.4,0.4; B2 0,0.4; B3 0.4,0.4; C1 -0.4,0; C2 0,0; C3 0.4,0; D1 -0.4,-0.4; D2 0,-0.4; D3 0.4,-0.4; E1 -0.4,-0.8; E2 0,-0.8; E3 0.4,-0.8
SON127P800X600X80-9N = smd 0.95 x 0.45: 1 -3.9,1.905; 2 -3.9,0.635; 3 -3.9,-0.635; 4 -3.9,-1.905; 5 3.9,-1.905; 6 3.9,-0.635; 7 3.9,0.635; 8 3.9,1.905 | smd 3.45 x 4.35: 9 0,0
SOT95P230X110-3N = smd 1.168 x 0.533: 1 -1.092,0.94; 2 -1.092,-0.94; 3 1.092,0
SOIC127P600X175-8N = smd 1.5 x 0.65: 1 -2.7,1.905; 2 -2.7,0.635; 3 -2.7,-0.635; 4 -2.7,-1.905; 5 2.7,-1.905; 6 2.7,-0.635; 7 2.7,0.635; 8 2.7,1.905
BGA9C40P3X3_144X135X69 = smd 0.216 x 0.216: A1 -0.4,0.4; A2 0,0.4; A3 0.4,0.4; B1 -0.4,0; B2 0,0; B3 0.4,0; C1 -0.4,-0.4; C2 0,-0.4; C3 0.4,-0.4
HC-FPC-05-20-15RLTAG = smd 0.3 x 1.5: 1 -3.5,1.55; 2 -3,1.55; 3 -2.5,1.55; 4 -2,1.55; 5 -1.5,1.55; 6 -1,1.55; 7 -0.5,1.55; 8 0,1.55; 9 0.5,1.55; 10 1,1.55; 11 1.5,1.55; 12 2,1.55; 13 2.5,1.55; 14 3,1.55; 15 3.5,1.55 | smd 1.5 x 2.5: 16 -5.2,-1.55; 17 5.2,-1.55
LQP15MN10NG02D = smd 0.525 x 0.55: 1 -0.463,0; 2 0.463,0
INDC1006X60N = smd 0.56 x 0.729: 1 -0.485,0; 2 0.485,0
INDC2016X100N = smd 1.2 x 2.2: 1 -1.028,0; 2 1.028,0
SOT96P240X120-3N = smd 1.55 x 0.65: 1 -0.85,0.96; 2 -0.85,-0.96; 3 0.85,0
VARC1005X41N = smd 0.85 x 0.65: 1 -0.55,0; 2 0.55,0
QFN40P700X700X90-57N = smd 0.81 x 0.22: 1 -3.445,2.6; 2 -3.445,2.2; 3 -3.445,1.8; 4 -3.445,1.4; 5 -3.445,1; 6 -3.445,0.6; 7 -3.445,0.2; 8 -3.445,-0.2; 9 -3.445,-0.6; 10 -3.445,-1; 11 -3.445,-1.4; 12 -3.445,-1.8; 13 -3.445,-2.2; 14 -3.445,-2.6; 29 3.445,-2.6; 30 3.445,-2.2; 31 3.445,-1.8; 32 3.445,-1.4; 33 3.445,-1; 34 3.445,-0.6; 35 3.445,-0.2; 36 3.445,0.2; 37 3.445,0.6; 38 3.445,1; 39 3.445,1.4; 40 3.445,1.8; 41 3.445,2.2; 42 3.445,2.6 | smd 0.22 x 0.81: 15 -2.6,-3.445; 16 -2.2,-3.445; 17 -1.8,-3.445; 18 -1.4,-3.445; 19 -1,-3.445; 20 -0.6,-3.445; 21 -0.2,-3.445; 22 0.2,-3.445; 23 0.6,-3.445; 24 1,-3.445; 25 1.4,-3.445; 26 1.8,-3.445; 27 2.2,-3.445; 28 2.6,-3.445; 43 2.6,3.445; 44 2.2,3.445; 45 1.8,3.445; 46 1.4,3.445; 47 1,3.445; 48 0.6,3.445; 49 0.2,3.445; 50 -0.2,3.445; 51 -0.6,3.445; 52 -1,3.445; 53 -1.4,3.445; 54 -1.8,3.445; 55 -2.2,3.445; 56 -2.6,3.445 | smd 4 x 4: 57 0,0
SON40P200X200X80-11N = smd 0.76 x 0.22: 1 -0.985,0.8; 2 -0.985,0.4; 3 -0.985,0; 4 -0.985,-0.4; 5 -0.985,-0.8; 6 0.985,-0.8; 7 0.985,-0.4; 8 0.985,0; 9 0.985,0.4; 10 0.985,0.8 | smd 0.9 x 1.5: 11 0,0
SON50P200X200X80-9N = smd 0.76 x 0.27: 1 -0.985,0.75; 2 -0.985,0.25; 3 -0.985,-0.25; 4 -0.985,-0.75; 5 0.985,-0.75; 6 0.985,-0.25; 7 0.985,0.25; 8 0.985,0.75 | smd 0.9 x 1.3: 9 0,0
EVPAKE31A = smd 1.1 x 0.7: P$1 0.15,1.4; P$3 0.15,-1.4 | smd 1.1 x 1.4: P$2 0,0 | drill 0.6 pad 0.8: P$4 1.45,2; P$5 1.45,-2
TE054003-1 = smd 0.7 x 0.7: DUMMY -2.95,1.4; LEAD+ -2.95,-2.2; LEAD- 1.95,-2.2
TYPE-C16PCB0.8073 = smd 0.6 x 1: A1B12 -3.21,2.611; A4B9 -2.41,2.611; B1A12 3.21,2.611; B4A9 2.41,2.611 | smd 0.3 x 1: A5 -1.25,2.61; A6 -0.25,2.61; A7 0.25,2.61; A8 1.25,2.61; B5 1.75,2.61; B6 0.75,2.61; B7 -0.75,2.61; B8 -1.75,2.61 | drill 0.6 slot 1.4 rotated 90: P$13 5.6,1.389; P$14 5.6,-2.54; P$15 -5.6,1.389; P$16 -5.6,-2.611
LMD2718T261-OA1 = smd 0.55 x 0.55: CLK 0.525,-0.98; DATA 0.525,0; GND -0.525,0.98; GND1 -0.525,-0.98; L/R -0.525,0; VDD 0.525,0.98
XTAL_7M40000010 = smd 1.2 x 1.4: 1 -0.85,1.1; 2 -0.85,-1.1; 3 0.85,-1.1; 4 0.85,1.1
XTAL_NX3215SA-32.768K-STD-MUA-8 = smd 1 x 1.8: 1 -1.25,0; 2 1.25,0

### Placement (x,y rotation side)
3V3  5.93,32.09 0 bottom
3V3_2  24.73,4.69 0 bottom
ANT1  11.71,4.74 270 top
C1  2.37,16.05 135 top
C2  28.78,27.8 180 top
C3  17.37,21.12 180 top
C4  28.55,23.25 270 top
C5  28.59,23.94 270 top
C6  19.02,21.69 0 top
C7  18.52,21.69 0 top
C8  17.99,16.3 270 top
C9  18.94,16.9 180 top
C10  19.43,16.9 180 top
C11  22.73,14.54 270 top
C12  17.89,21.13 180 top
C13  9.29,12.27 270 top
C14  32.78,9.99 0 top
C15  9.72,34.19 180 top
C16  32.63,12.65 0 top
C17  8.66,9.76 0 top
C18  11.93,31.19 90 top
C19  10.93,30.69 0 top
C20  30.16,37.24 270 top
C21  29.53,28.37 270 top
C22  24.89,37.7 180 top
C23  35.08,28.24 180 top
C24  29.57,19.83 270 top
C25  26.47,26.78 180 top
C26  25.86,32.59 0 top
C27  16.32,21.95 180 top
C28  29.67,16.11 90 top
C30  34.43,31.22 180 top
C31  14.39,26.31 90 top
C32  15.05,12.97 90 top
C33  26.49,25.65 180 top
C34  30.52,36.51 180 top
C35  24.88,36.26 0 top
C36  13.5,8.22 270 top
D1  33.13,25.01 180 top
GND  27.5,4.65 0 bottom
IC1  30.53,18.02 180 top
IC2  16.12,24.24 180 top
IC3  27.96,37.25 270 top
IC4  16.12,32.4 90 top
IC5  32.33,31.55 90 top
IC7  22.73,31.62 270 top
IC8  10.93,28.39 0 top
IC9  28.84,26.31 270 top
J1  21.84,4.74 180 top
L1  11.73,7.76 90 top
L2  19.83,15.41 180 top
L3  15.65,16.61 45 top
L4  12.61,8.72 270 top
L5  27.89,35 180 top
L7  31.82,27.25 270 top
O+  3.02,25.06 0 top
O-  2.04,22.76 0 top
Q1  29.79,4.94 270 top
R1  10.21,31.19 90 top
R2  19.22,19.98 270 top
R3  10.41,34.23 0 top
R4  33.49,11.46 180 top
R5  24.02,1.51 90 top
R6  32.83,23.9 180 top
R7  33.48,18.91 180 top
R8  9.21,9.82 180 top
R9  35.64,28.26 180 top
R10  35.35,32.57 0 top
R11  32.44,23.11 90 top
R12  28.34,14.97 270 top
R13  28.39,15.52 270 top
R14  31.81,7.29 180 top
R15  32.45,7.29 0 top
R16  34.46,33.6 90 top
R17  10.85,35.52 90 top
R18  10.53,37.42 180 top
RV1  22.47,12.98 270 top
SCL  21.83,4.69 0 bottom
SCL_DC  12.39,38.52 0 bottom
SDA  19.09,4.65 0 bottom
SDA_DC  12.4,35.87 0 bottom
TP1  32.48,35.44 0 top
TP3  35.04,35.44 0 top
TP5  1.65,20.28 0 bottom
TP11  1.62,17.78 0 bottom
U1  23.87,19.95 90 top
U2  36,30.51 90 top
U4  27.8,32.45 0 top
U$1  8.74,35.21 135 top
U$3  6.79,9.23 220 top
U$4  5.76,29.97 90 top
U$5  36.96,20.4 90 top
U$6  3.4,14.33 45 top
VREG  35.73,30.59 0 bottom
Y1  12.21,12.67 270 top
Y2  35.19,11.45 90 top

### Tracks (layer width: path | path; a pad name or v marks a point on that pad's centre or on a via)
3V3  (via drill 0.3, 0.3 pad 0.46, 0.35)
  Top 0.152: v17.44,21.9 17.37,21.83 C3.2 | v9.33,32.49 9.33,32.7 10.41,33.78 R3.2 | 19.08,21.35 U1.46 20.97,21.35 | 21.23,21.09 20.97,21.35 | 20.97,21.35 21.43,21.81 v21.43,22.56 | U1.20 27.33,19.37 28.68,19.37 v28.78,19.26 28.78,19.43 29.19,19.83 C24.2 29.3,19.78 29.34,19.73 29.34,18.79 IC1.8 | v9.95,10.07 9.93,10.1 R8.2 | 29.66,15.52 29.94,15.8 C28.2 29.94,17.02 IC1.12 30.03,17.46 30.24,17.67 30.31,17.67 31.03,18.38 IC1.5 30.98,18.98 30.98,19.33 30.69,19.62 v30.6,19.62 | 20.03,17.18 20.25,17.18 U1.56 U1.55 20.44,17.77 21.03,17.77 21.23,17.96 | v13.56,26.37 13.56,25.6 v14.01,25.15 | IC9.E2 IC9.E3 27.25,25.91 C33.1 | v10.05,35.14 10.43,35.52 R17.1 10.55,35.52 10.55,36.99 10.48,37.06 R18.1
  Top 0.254: C3.2 17.39,21.41 C12.2 C7.2 C6.2 19.08,21.35 | v17.19,16.56 17.45,16.82 17.97,16.82 C8.1 18.34,16.8 18.63,17.08 18.84,17.08 C9.2 C10.2 20.03,17.18 19.93,17.08 19.93,16.37 19.34,15.78 L2.2 | R13.1 29.66,15.52 29.51,15.37 29.48,15.37 29.08,14.97 R12.1 | 21.23,17.96 21.23,21.09 | C33.1 26.99,26.76 | 26.99,26.76 C25.1 | v26.36,27.72 26.99,27.09 26.99,26.76 | v7.86,32.7 9.12,32.7 v9.33,32.49
  Route15 0.152: 17.07,22.23 17.11,22.23 v17.44,21.9 | 14.27,25.04 14.11,25.04 v14.01,25.15 | v30.6,19.62 28.89,19.37 v28.78,19.26 | 9.53,32.29 10.05,32.81 v10.05,35.14
  Route15 0.254: v9.33,32.49 9.53,32.29 11.66,30.16 11.93,30.16 13.56,28.54 v13.56,26.37 | v17.19,16.56 17.19,11.85 15.41,10.07 v9.95,10.07 | 17.07,22.23 14.27,25.04 | v30.6,19.62 30.18,20.03 30.18,20.34 28.03,20.34 26.62,21.75 26.62,25.49 | 26.62,25.49 26.62,27.46 v26.36,27.72 | 26.62,25.49 25.54,24.41 22.41,24.41 21.43,23.43 v21.43,22.56
  Bottom 0.254: 3V3.TP 7.25,32.09 v7.86,32.7
3V3_2  (via drill 0.3, 0.3 pad 0.46)
  Top 0.152: C19.2 IC8.A2 | C18.1 v12.93,30.69 | C31.2 15.51,26.3 v15.66,26.45 16.09,26.02 16.09,24.77 IC2.C2 | v18.11,23.11 17.24,23.11 IC2.A1 | v24.31,7.44 24.02,7.44 23.83,7.25 23.83,5.99 | 23.83,5.99 J1.4 23.83,1.6 R5.1 21.47,1.51 20.84,2.14 J1.10 | 26.03,36.85 IC3.E3 IC3.E2 | 23.83,5.99 24.43,5.99 v24.53,6.09
  Top 0.254: C18.1 11.66,30.42 C19.2 | v22.76,37.44 23.94,36.26 C35.1 24.38,36.57 24.8,36.99 25.61,37.28 | C22.1 25.39,37.49 25.61,37.28 | 26.03,36.85 25.61,37.28 | v3.02,16.65 2.97,16.65 C1.2 3.08,15.73 U$6.VDD | IC4.3 16.76,29.23 v17.02,29.49 | v16.33,37.49 16.33,37.15 IC4.7 IC4.8
  Route15 0.152: v24.31,7.44 24.33,7.46 24.33,15.59 26.13,17.39 26.13,21.99 20.71,21.99 19.55,23.15 18.79,23.15 18.45,23.49 18.36,23.49 18.11,23.25 v18.11,23.11
  Route15 0.254: 16.33,29.49 v17.02,29.49 v17.03,29.49 17.03,32.14 16.33,32.84 v16.33,37.49 22.71,37.49 v22.76,37.44 | v12.93,30.69 13.52,30.1 14.94,30.1 15.54,29.49 16.33,29.49 | 17.44,26.46 16.93,26.46 16.93,26.45 v15.66,26.45 15.59,26.45 15.43,26.29 14.55,26.29 14.02,25.76 12.8,25.76 11.68,26.88 8.68,26.88 8.54,27.01 7.26,27.01 3.54,23.29 3.54,18.59 3.53,18.59 3.53,17.16 v3.02,16.65 | 17.44,26.46 18.36,25.54 18.36,23.49 | 16.33,29.49 16.33,27.56 17.44,26.46
  Bottom 0.152: v24.53,6.09 24.63,5.99 24.63,4.79 3V3_2.TP
ALERT  (via drill 0.3 pad 0.46)
  Top 0.152: v27.79,16.31 27.32,16.78 U1.15 | U4.5 28.09,31.01 v28.09,30.69
  Route15 0.152: v28.09,30.69 28.42,30.36 28.42,28.7 30.13,26.99 30.13,24.58 30.59,24.12 30.59,23.66 30.15,23.22 30.15,21.28 31.18,20.25 31.18,18.53 30.08,17.43 29.18,17.43 28.05,16.31 v27.79,16.31
BCLK
  Top 0.152: U1.44 20.41,22.17 19.92,22.17 19.73,22.36 19.73,23.2 18.58,24.34 18.58,25.63 17.2,27.01 16.36,27.01 16.08,27.29 13.02,27.29 12.56,26.83 12.1,26.83 11.62,27.31 11.07,27.31 10.55,27.83 10.55,27.98 IC8.C1
BOOT  (via drill 0.3 pad 0.46)
  Top 0.152: U1.5 22.87,15.63 v22.73,15.49 | U$1.P$1 8.24,33.73 8.72,33.73 9.45,34.46 C15.2 9.76,34.51 R3.1 12.02,34.51 v13.03,33.49
  Bottom 0.152: v13.03,33.49 14.03,32.49 14.03,27.23 14.57,26.69 14.57,24.97 16.09,23.45 16.98,23.45 22.5,17.93 22.95,17.93 23.38,17.49 23.38,16.49 arc-45 23.13,15.9 v22.73,15.49
CC1
  Top 0.152: U$5.A5 33.51,19.15 R7.2
CC2
  Top 0.152: U$5.B5 33.82,22.15 32.86,23.11 R11.2
CHG  (via drill 0.3)
  Top 0.152: U1.27 27.33,22.17 28.39,22.17 28.75,22.52 29.34,22.52 30.58,23.77 v31.26,23.77 | v36.63,32.95 36,32.33 U2.8
  Bottom 0.152: v31.26,23.77 31.64,24.15 31.64,24.5 34.18,27.04 38.34,27.04 38.85,27.55 38.85,32.18 38.08,32.95 v36.63,32.95
D+  (via drill 0.35)
  Top 0.152: U1.26 28.5,21.75 28.99,22.24 30.89,22.24 v31.24,22.6 32.96,22.6 33.41,22.15 33.41,21.39 33.65,21.15 U$5.B6 | U$5.A6 33.64,20.15 32.68,21.12 32.48,21.31 v32.48,21.6
  Bottom 0.152: v32.48,21.6 32.24,21.6 v31.24,22.6
D-
  Top 0.152: U1.25 28.49,21.35 29.1,21.97 31.28,21.97 | 31.28,21.97 32.25,20.99 32.25,20.66 33.28,19.63 34.33,19.63 U$5.B7 | 31.28,21.97 32,21.97 32.23,22.19 32.95,22.19 33.08,22.06 33.08,21.11 33.54,20.65 U$5.A7
DIN
  Top 0.152: U1.45 19.94,21.75 19.74,21.94 19.45,22.24 19.45,23.08 17.94,24.59 17.94,25.89 17.09,26.73 16.25,26.73 15.97,27.01 13.14,27.01 12.68,26.55 11.98,26.55 11.5,27.03 10.95,27.03 9.83,28.15 9.83,28.19 10.03,28.39 IC8.B1
EN_LDO2  (via drill 0.3, 0.3 pad 0.46)
  Top 0.127: U1.24 28.5,20.95 28.82,21.28 29.25,21.28 29.38,21.4 v29.49,21.4 | 29.56,37.79 31.62,37.79 32.29,37.12 33.09,37.12 33.76,36.45 33.76,34.83 33.61,34.68 33.61,34.36 | R16.1 33.77,34.02 v33.77,34.19
  Top 0.152: v33.77,34.19 33.61,34.36 | 29.56,37.79 28.9,37.79 IC3.A1
  Bottom 0.152: v29.49,21.4 30.2,22.12 30.2,30.71 33.68,34.19 v33.77,34.19
GND  (via drill 0.3, 0.3 pad 0.46, 0.35)
  Top 0.152: IC8.B2 IC8.C2 10.95,27.98 10.95,27.83 11.19,27.59 11.83,27.59 | Y1.2 10.36,12.77 C13.1 | 11.11,14.77 11.13,14.79 | C14.1 32.28,8.65 32.43,8.49 | C11.1 23.1,14.44 23.1,13.93 23.17,13.87 23.17,13.09 22.51,12.43 RV1.2 | C10.1 C9.1 | C24.1 30.03,19.65 IC1.7 IC1.6 | IC1.3 IC1.2 IC1.1 | C12.1 17.39,20.86 C3.1 | C7.1 C6.1 | U2.3 U2.11 36,30.61 36.39,31 36.39,31.48 U2.7 | C31.1 14.12,25.91 14.28,25.75 15.01,25.75 | C16.1 32.13,13.3 v32.68,13.85 | C4.1 29.38,23.81 v29.38,23.99 | C15.1 9.72,33.88 9.15,33.31 | IC9.C3 IC9.C2 IC9.C1 | IC9.B1 IC9.C1 | IC3.B1 IC3.C1 IC3.C2 IC3.C3 | IC9.C1 28.86,26.73 28.86,27.45 C2.1 | C34.1 31.02,36.57 | U$1.P$3 9.13,36.31 8.71,36.73
  Top 0.254: 11.11,14.77 Y1.2 | C13.1 8.45,12.77 8.43,12.79 | 13.33,9.49 13.33,11.8 Y1.4 14.4,11.82 C32.1 | 16.34,4.49 v16.42,4.41 | U4.6 28.05,32.2 U4.9 | U4.9 27.77,32.42 27.77,31.66 26.86,31.66 U4.4 | U4.9 27.8,33.18 27.87,33.24 26.86,33.24 U4.1 | C33.2 25.99,26.76 C25.2 | U$5.P$13 35.57,25.97 34.76,25.15
  other vias: 9.33,29.49 37.73,30.49 34.13,30.19 37.63,31.99 25.37,6.75 12.33,27.39 10.43,14.89 7.13,11.09 15.17,21.22 30.08,18.23 32.22,24.1 18.89,22.54 14.33,23.9 15.23,25.59 32.03,15.19 31.23,14.09 30.63,12.89 30.63,11.49 31.03,10.39 33.93,14.49 34.63,13.79 32.03,16.29 8.88,8.31 9.94,8.28 11.43,8.85 11.63,9.43 15.78,9.08 17.5,10.28 18.28,11.04 19.11,11.88 19.86,12.58 20.63,14.09 18.29,9.14 19.08,9.89 20.61,11.38 21.28,12.04 16.42,3.7 16.41,2.93 16.43,1.39 11.93,14.99 13.08,16.09 14.31,17.32 14.13,14.84 18.03,17.49 15.43,18.39 16.38,15.09 22.43,22.59 23.53,22.59 24.73,22.59 25.83,22.59 25.23,17.39 33.81,15.39 8.93,27.49 28.75,16.19 33.09,18.14 17.59,23.94 16.69,9.63 16.4,2.13 17.6,8.52 19.67,10.53 17.04,7.94 27.62,25.16 30.79,29.45 28.06,28.18 27.88,35.25 31.12,37.24 37.6,27.94 37.52,25.97 8.04,36.23 14.96,8.81 13.54,9.45 10.83,8.3 20.48,13.32 17.83,7.37 17.81,6.49 17.82,5.77 17.22,4.45 17.79,5.07 14.13,9.07
  pour Route2: -8.54,-4.38 42.28,-4.38 47.2,0.55 47.2,44.37 -8.54,44.37
  pour Bottom: -8.54,-4.38 42.28,-4.38 47.2,0.55 47.2,44.37 -8.54,44.37
  pour Top: -8.54,-4.38 42.28,-4.38 47.2,0.55 47.2,44.55 -8.54,44.55
IMU_INT1  (via drill 0.3 pad 0.46)
  Top 0.127: U1.23 28.49,20.55 28.8,20.86 30.48,20.86 v30.95,21.33
  Top 0.152: IC1.4 31.75,18.83 v31.75,19.45
  Bottom 0.152: v30.95,21.33 30.95,21.27 31.75,20.47 v31.75,19.45
IMU_INT2
  Top 0.152: U1.19 27.33,18.94 28.31,18.94 28.98,18.27 IC1.9
ISET
  Top 0.152: R9.2 35.6,28.57 U2.2
LED_BL
  Top 0.152: U1.12 25.67,9.51 26.04,9.15 26.86,9.15 28.44,7.56 R14.2
LEDA
  Top 0.152: J1.3 24.34,1.56 R5.2
LEDK
  Top 0.152: Q1.2 28.83,3.58 26.95,1.7 25.18,1.7 24.84,2.04 J1.2
LNA_IN
  Top 0.152: U1.1 21.28,16.5 21.28,13.12 16.49,8.33 16.48,8.32 16.38,8.22 C36.1
LRCLK
  Top 0.152: U1.43 20.43,22.9 18.86,24.46 18.86,25.75 17.32,27.29 16.48,27.29 16.2,27.57 14.05,27.57 13.51,28.11 12.16,28.11 12.04,27.99 IC8.C3
LX1
  Top 0.152: IC9.B2 IC9.B3 29.24,25.67 29.39,25.52 29.95,25.52 30.42,25.99 30.42,27.61 31.09,28.28 L7.1
LX2
  Top 0.152: IC9.D2 IC9.D3 28.44,25.38 28.87,24.95 30.55,24.95 L7.2
LX3
  Top 0.152: L5.1 28.92,35.69 28.35,36.26 IC3.B3 IC3.B2
LX4
  Top 0.152: L5.2 26.86,35.55 27.56,36.25 IC3.D3 IC3.D2
N$1
  Top 0.152: R1.1 10.28,30.62 10.28,30.38 10.53,30.13 IC8.A1
N$2
  Top 0.152: L3.1 arc-90 15.09,16.05 arc90 14.85,15.82 arc90 15.09,15.58 15.56,15.58 arc-90 15.79,15.35 arc-90 15.56,15.11 15.34,15.11 arc90 15.11,14.88 arc90 15.34,14.64 15.56,14.64 arc-90 15.79,14.41 arc-90 15.56,14.17 arc90 15.32,13.94 15.32,13.75 C32.2 15,13.52 Y1.1
N$3
  Top 0.152: L1.1 11.73,6.26 ANT1.1
N$4
  Top 0.152: C36.2 13.19,8.26 L4.2 12.57,8.22 L1.2
N$7
  Top 0.152: U1.49 20.41,20.14 19.92,20.14 19.76,19.98 R2.1
N$17
  Top 0.152: R15.2 R14.1 31.81,6.85 Q1.1
N$19
  Top 0.152: C27.2 16.32,23.44 16.12,23.64 IC2.A2
OUT+  (via drill 0.3 pad 0.46)
  Top 0.152: v4.33,25.49 3.45,25.49 O+.TP | IC2.A3 14.96,23.09 v14.88,23.09
  Bottom 0.152: v4.33,25.49 5.25,25.49 6.69,26.93 11.48,26.93 13.34,25.07 13.34,25.02 13.88,24.48 14.54,24.48 14.89,24.13 14.89,23.66 14.88,23.65 v14.88,23.09
OUT-
  Top 0.152: O-.TP 2.99,22.76 5.85,25.61 5.85,28.11 6.83,29.09 8.92,29.09 9.49,28.52 9.49,27.64 10.46,26.67 arc-41 12.7,25.66 13.88,24.48 14.4,24.48 14.81,24.89 15.41,24.89 15.56,24.74 IC2.C3
OUTN  (via drill 0.3 pad 0.46)
  Top 0.152: IC8.B3 12.13,28.39 v12.43,28.69 | v7.93,30.49 7.93,31.89 U$4.LEAD-
  Route15 0.152: v12.43,28.69 9.24,28.69 8.77,29.16 8.77,29.65 v7.93,30.49
OUTP  (via drill 0.3 pad 0.46)
  Top 0.152: IC8.A3 11.65,29.11 v11.65,29.48 | U$4.LEAD+ 7.96,27.85 8,27.9 v8,27.92
  Bottom 0.152: v11.65,29.48 10.9,28.73 8.83,28.73 8.02,27.92 v8,27.92
PDM_CLK
  Top 0.152: U1.48 18.7,20.55 18.13,19.98 17.02,19.98 16.76,20.24 15.72,20.24 14.95,19.47 14.95,18.78 11.65,15.48 9.55,15.48 9.19,15.12 5.58,15.12 U$6.CLK
PDM_DATA
  Top 0.152: U1.47 18.68,20.95 17.99,20.26 17.21,20.26 16.94,20.53 15.59,20.53 14.63,19.57 14.63,18.86 11.57,15.8 4.87,15.8 U$6.DATA
RST  (via drill 0.3 pad 0.46)
  Top 0.152: U1.4 22.46,16.52 22.46,17.33 v22.5,17.37 | U$3.P$1 8.66,9.15 C17.2 9.15,9.48 R8.1 9.47,9.29 v10.53,9.29
  Bottom 0.152: v10.53,9.29 11.55,10.31 14.66,10.31 21.19,16.84 21.96,16.84 v22.48,17.37 v22.5,17.37
RX  (via drill 0.3 pad 0.46)
  Top 0.127: 18.13,19.11 19.3,19.11 19.94,19.75 U1.50
  Top 0.152: v18.11,19.1 v18.12,19.1 18.13,19.11
  Bottom 0.127: TP11.TP 1.88,18.04 4.56,18.04 6.98,15.62 10.33,15.62 11.7,15.62 15.17,19.09
  Bottom 0.152: 15.17,19.09 v18.1,19.09 v18.11,19.1
SCL  (via drill 0.3, 0.3 pad 0.46)
  Top 0.152: 27.33,15.52 R13.2 | IC1.13 30.53,14.95 30.34,14.76 v29.73,14.76 | 27.33,15.52 26.47,16.38 U1.14 | 27.33,15.52 v27.26,15.45 | v19.03,8.39 19.03,7.97 18.44,7.38 18.44,5.47 18.38,5.41 18.38,3.25 18.39,3.24 J1.15 | v17.18,25.85 16.62,25.28 IC2.C1 | v25.21,26.14 25.21,27.11 v24.83,27.49 26.06,28.72 26.06,29.32 26.67,29.93 28.2,29.93 28.82,30.55 29.39,30.55 30.33,31.49 30.33,32.49 30.04,32.78 | U4.7 28.81,32.72 29.98,32.72 30.04,32.78 | IC3.D1 27.56,37.8 27.84,38.08 32.33,38.08 v32.5,37.91 | 30.04,32.78 30.52,33.26 30.52,34.17 v30.04,34.65 v30.03,34.65
  Route15 0.127: v29.73,14.76 29.72,14.76
  Route15 0.152: 29.72,14.76 29.03,15.45 v27.26,15.45
  Bottom 0.152: v25.21,26.14 25.21,25.79 26.81,24.19 26.81,16.49 27.26,16.05 v27.26,15.45 27.26,14.98 20.67,8.39 19.83,8.39 | 19.83,8.39 v19.03,8.39 | v17.18,25.85 23.18,25.85 v24.83,27.49 | v30.03,34.65 32.5,37.12 v32.5,37.91 | SCL.TP 21.83,6.39 19.83,8.39
SCL_DC  (via drill 0.3)
  Top 0.127: IC9.D1 28.44,26.87 27.38,27.93 27.38,28.42 27.89,28.93 27.89,29.28 v27.83,29.34
  Top 0.152: v10.53,38.24 R18.2
  Route15 0.127: v27.83,29.34 26.39,30.78 25.59,30.78 20.42,35.95 v20.42,36.64
  Bottom 0.127: v20.42,36.64 20.14,36.36 14.55,36.36 SCL_DC.TP
  Bottom 0.152: SCL_DC.TP 12.11,38.24 v10.53,38.24
SD_MODE  (via drill 0.3 pad 0.46)
  Top 0.152: U1.38 22.87,25.05 19.66,28.26 v19.66,31.49 | R1.2 10.21,32.17 10.91,32.87 v11.33,32.87
  Bottom 0.152: v19.66,31.49 17.26,31.49 14.36,34.39 12.73,34.39 11.33,32.99 v11.33,32.87
SDA  (via drill 0.3, 0.3 pad 0.35, 0.3 pad 0.46, 0.35)
  Top 0.089: IC2.B2 16.37,24.49 17.07,24.49 17.34,24.76 v17.34,24.89
  Top 0.152: IC1.14 31.03,14.9 30.33,14.2 27.62,14.2 27.33,14.49 | U1.13 26.08,16.49 26.08,15.74 26.88,14.94 | R12.2 27.59,14.49 27.33,14.49 | 26.88,14.94 27.33,14.49 | v20.03,9.15 20.03,8.54 19.05,7.56 v19.05,6.06 18.81,5.82 18.81,3.22 J1.14 | 26.88,14.94 v26.41,14.94 | U4.8 29.44,33.2 v29.72,33.48 | IC3.E1 26.51,37.65 v26.42,37.74
  Bottom 0.152: 24.65,25.81 23.52,24.68 17.89,24.68 17.62,24.94 17.39,24.94 v17.34,24.89 | v20.03,9.15 21.03,9.15 26.34,14.46 26.34,14.88 v26.41,14.94 26.43,14.97 26.43,24.02 24.65,25.81 | 24.65,25.81 24.36,26.09 25.47,27.2 25.47,29.43 27.53,31.49 29.63,31.49 29.72,31.58 v29.72,33.48 29.56,33.64 26.34,33.64 25.83,34.15 25.83,35.51 26.02,35.7 26.02,37.34 v26.42,37.74 | v19.05,6.06 19.09,6.02 SDA.TP
SDA_DC  (via drill 0.3)
  Top 0.127: 26.96,27.74 27.12,27.58 27.28,27.58 28.04,26.82 IC9.E1
  Top 0.152: R17.2 v11.13,36.43 | 26.96,27.74 26.96,28.97 v26.82,29.11
  Route15 0.152: v26.82,29.11 24.52,31.41 24.03,31.41 v19.73,35.71
  Bottom 0.152: v11.13,36.43 11.69,35.87 SDA_DC.TP 12.56,35.71 v19.73,35.71
SPI2_CLK
  Top 0.152: U1.41 21.66,23.41 21.66,23.91 18.75,26.81 18.75,34.06 16.76,36.06 IC4.6
SPI2_MISO
  Top 0.152: U1.42 21.27,23.74 17.44,27.57 16.59,27.57 16,28.16 15.84,28.32 15.66,28.5 IC4.2
SPI2_MOSI
  Top 0.152: U1.40 22.07,23.89 19.03,26.93 19.03,35.3 IC4.5
SPI3_CLK  (via drill 0.3 pad 0.46)
  Top 0.127: U1.17 27.34,18.18 27.81,18.18 27.92,18.29 v28.17,18.29
  Top 0.152: v22.78,7.91 22.78,7.82 22.34,7.38 J1.7
  Bottom 0.127: 28.27,18.35 28.24,18.35 v28.17,18.29
  Bottom 0.152: v22.78,7.91 29.1,14.23 29.1,15.36 29.59,15.84 29.59,17.04 28.27,18.35
SPI3_MOSI  (via drill 0.3 pad 0.46)
  Top 0.127: U1.16 27.8,17.75 v28.23,17.33
  Top 0.152: v21.82,7.65 21.82,7.56 J1.8
  Bottom 0.152: v21.82,7.65 22.22,8.05 22.22,8.87 29.31,15.96 29.31,16.42 28.41,17.33 v28.23,17.33
SPICLK
  Top 0.152: IC7.6 22.45,28.56 22.45,26.78 24.87,24.36 U1.33
SPICS1
  Top 0.152: IC7.1 24.03,33.72 24.03,26.4 25.86,24.57 29.74,24.57 30.01,24.3 30.01,23.73 29.08,22.8 28.63,22.8 28.37,22.54 27.35,22.54 27.34,22.55 U1.28
SPID
  Top 0.152: U1.35 24.06,23.41 24.06,24.38 20.82,27.61 IC7.5
SPIHD
  Top 0.152: U1.30 26.06,23.41 26.06,23.98 23.36,26.67 IC7.7
SPIQ
  Top 0.152: IC7.2 22.69,34.99 22.69,35.49 22.49,35.69 21.7,35.69 21.49,35.49 21.49,27.34 24.46,24.37 24.46,23.41 U1.34
SPIWP
  Top 0.152: U1.31 25.66,23.41 25.66,23.98 22.73,26.91 22.73,33.68 IC7.3
SS_FLASH  (via drill 0.3 pad 0.46)
  Top 0.152: U1.39 22.46,23.41 22.46,24.7 20.11,27.04 v19.98,27.04 | v14.65,29.41 14.53,29.29 14.39,29.15 14.22,28.98 IC4.1
  Bottom 0.152: v19.98,27.04 19.33,26.39 17.67,26.39 v14.65,29.41
TFT_CS
  Top 0.152: U1.9 24.47,8.81 22.85,7.19 J1.6
TFT_DC
  Top 0.152: U1.10 24.87,8.8 23.33,7.26 23.33,3.2 J1.5
TFT_RST
  Top 0.152: U1.8 24.07,10.81 20.73,7.47 20.73,6.88 21.34,6.27 J1.9
TP_INT
  Top 0.152: U1.6 23.28,16.49 23.28,15.73 23.45,15.57 23.45,11.43 19.49,7.47 19.49,6.63 19.67,6.45 19.67,4.85 19.34,4.52 J1.13
TP_RST
  Top 0.152: U1.7 23.68,16.49 23.68,16 23.73,15.96 23.73,11.07 20.24,7.58 20.24,4.69 19.82,4.27 19.82,3.19 J1.12
TS
  Top 0.152: U2.9 35.6,32.05 R10.2
TX  (via drill 0.3 pad 0.46)
  Top 0.152: R2.2 18.64,19.98 18.33,19.67 v16.35,19.67
  Bottom 0.127: 2.67,20.28 7.09,15.87 11.59,15.87 14.91,19.19 14.91,19.2 15.35,19.64 15.36,19.64
  Bottom 0.152: TP5.TP 2.67,20.28 | v16.35,19.67 16.32,19.64 15.36,19.64
VBAT  (via drill 0.3, 0.3 pad 0.46)
  Top 0.152: C30.2 U2.10
  Top 0.254: C30.2 34.33,31.6 v34.33,32.49 | TP1.TP 32.63,35.29 v32.63,33.99 32.33,33.69 IC5.3 | U4.2 U4.3 26.71,32.31 C26.2 25.86,31.74 v25.77,31.65
  Route15 0.254: v34.33,32.49 32.83,33.99 v32.63,33.99 31.09,32.45 26.57,32.45 v25.77,31.65
VBUS  (via drill 0.3 pad 0.46)
  Top 0.152: U$5.B4A9 33.63,22.81 33.55,22.9 33.55,23.8 33.17,24.18 R6.2 33.67,25.01 D1.1 | U2.1 34.59,28.91 | 34.59,28.91 34.57,28.89 | 34.59,28.91 v34,28.91
  Top 0.254: U$5.A4B9 | U$5.A4B9 33.89,17.99 33.52,17.63 33.52,16.68 v33.81,16.39 | D1.1 33.98,25.99 v34.06,26.06 | C23.2 34.95,28.51 34.57,28.89 | v32.56,29.49 31.6,30.45 IC5.1
  Route15 0.254: 32.76,26.06 32.57,26.25 32.57,28.53 | 32.57,28.53 32.53,28.49 32.53,29.42 32.56,29.45 v32.56,29.49 | 32.57,28.53 32.95,28.91 v34,28.91 | v34.06,26.06 32.76,26.06 | 32.76,26.06 33.96,24.86 33.96,16.54 v33.81,16.39
VDD3P3  (via drill 0.3 pad 0.46)
  Top 0.152: 22.07,15.22 U1.3 U1.2 21.66,17.28 v21.54,17.4 | v19.51,14.21 19.81,14.21
  Top 0.254: RV1.1 22.42,13.58 22.45,13.62 C11.2 22.45,14.84 22.07,15.22 | 19.81,14.21 20.31,14.71 L2.1
  Route15 0.152: v19.51,14.21 19.51,15.58 21.33,17.4 v21.54,17.4
VDD_SPI  (via drill 0.3, 0.35)
  Top 0.152: v27.73,23.99 26.88,23.99 26.47,23.59 U1.29 26.61,23.25 C4.2 28.32,23.3 C5.2
  Top 0.254: IC7.8 24.65,28.94 v24.65,30.47
  Route15 0.254: v24.65,30.47 24.65,30.34 28.32,26.67 28.32,24.58 v27.73,23.99
VREG  (via drill 0.3, 0.35)
  Top 0.152: IC9.A3 IC9.A2 IC9.A1 29.64,27.69 29.68,27.73 | IC3.A3 IC3.A2 29.5,36.51 C34.2
  Top 0.254: D1.2 33.19,25.01 33.32,25.14 33.32,30.41 IC5.2 | C20.2 29.89,37.02 30.02,36.88 C34.2 30.02,36.15 v30.38,35.79 | v31.3,34.11 31.39,34.02 31.39,32.15 v32.1,31.44 32.29,31.44 IC5.2 | 29.68,27.73 C21.2 29.24,27.87 29.03,28.08 C2.2 28.78,29.48 v29.12,29.82 | IC5.2 33.27,31.43 v33.33,31.49
  Route15 0.254: v29.12,29.82 29.77,30.47 29.77,31.2 30.01,31.44 v32.1,31.44 | v31.3,34.11 31.3,34.87 v30.38,35.79
  Bottom 0.254: VREG.TP 34.83,31.49 v33.33,31.49
XTAL_32K_N
  Top 0.152: U1.22 28.49,20.15 28.91,20.57 31.92,20.57 32.65,19.84 32.65,18.55 32.53,18.44 32.53,17.85 32.91,17.47 32.91,16.34 arc90 33.02,16.24 33.15,16.24 arc-90 33.25,16.13 33.25,15.88 arc-90 33.15,15.77 33.02,15.77 arc90 32.91,15.66 32.91,15.41 arc90 33.02,15.3 33.15,15.3 arc-90 33.25,15.19 33.25,14.94 arc-90 33.15,14.83 33.02,14.83 arc90 32.91,14.72 32.91,14.59 34.8,12.7 Y2.2 33.17,12.7 C16.2 33.13,12.1 R4.2
XTAL_32K_P
  Top 0.152: U1.21 28.49,19.75 29.03,20.29 31.77,20.29 32.35,19.71 32.35,18.65 32.25,18.55 32.25,17.73 32.63,17.36 32.63,14.59 31.23,13.19 31.23,11.29 31.91,10.61 33.37,10.61 33.49,10.49 | R4.1 33.49,10.49 | 33.49,10.49 33.49,10.2 C14.2 33.49,10.2 Y2.1
XTAL_N
  Top 0.152: U1.53 20.41,18.54 16.38,18.54 12.33,14.49 12.33,12.49 11.66,11.82 Y1.3 11.06,11.77 C13.2
XTAL_P
  Top 0.152: U1.54 17.19,18.15 16.95,17.91 arc-90 16.67,17.91 arc90 16.4,17.91 16.34,17.85 arc90 16.34,17.58 16.61,17.3 arc-90 16.61,17.03 16.55,16.97 arc-90 16.28,16.97 arc90 16.01,16.97 L3.2
(copper drawn outside any net)
  shapes: Bottom area x3, Route15 area x1, Route2 area x1, Top area x4

### Text on the board
tPlace: VBAT | DNP
bPlace: TX | RX
FabDoc1: Fill via